# EAGLE design BladeCore-M40 (EAGLE 9.2.1)

## Sheet 1 of 2
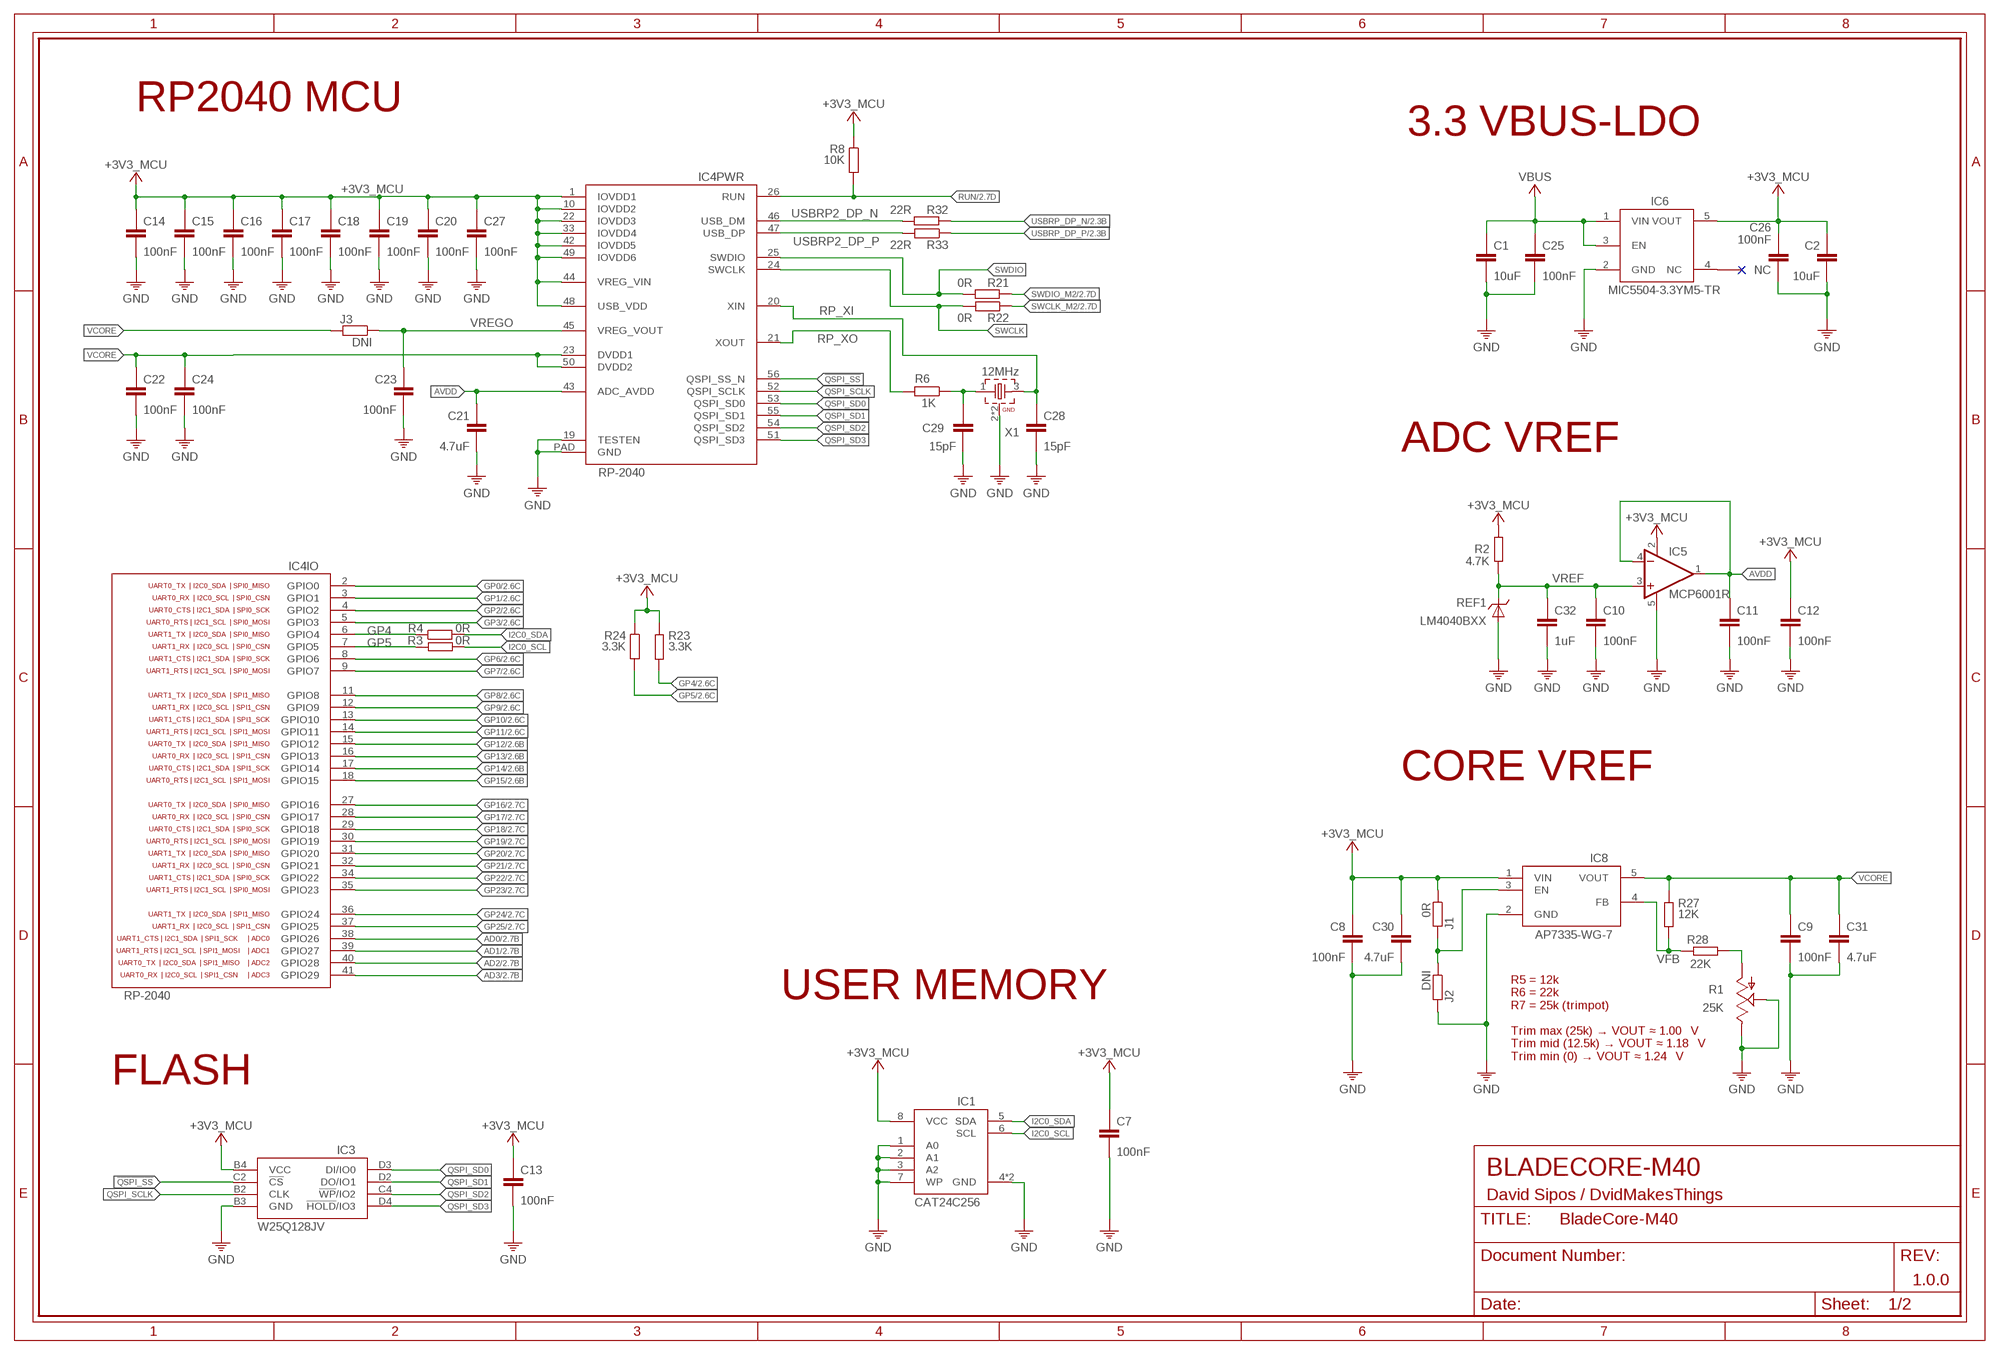
[diagram p0: schematic, sheet 1]

### Parts
C1  10uF  C0805  [0805]
C2  10uF  C0805  [0805]
C7  100nF  C-0201  [0201]
C8  100nF  C-0201  [0201]
C9  100nF  C-0201  [0201]
C10  100nF  C-0201  [0201]
C11  100nF  C-0201  [0201]
C12  100nF  C-0201  [0201]
C13  100nF  C-0201  [0201]
C14  100nF  C-0201  [0201]
C15  100nF  C-0201  [0201]
C16  100nF  C-0201  [0201]
C17  100nF  C-0201  [0201]
C18  100nF  C-0201  [0201]
C19  100nF  C-0201  [0201]
C20  100nF  C-0201  [0201]
C21  4.7uF  C-0402  [C0402]
C22  100nF  C-0201  [0201]
C23  100nF  C-0201  [0201]
C24  100nF  C-0201  [0201]
C25  100nF  C-0201  [0201]
C26  100nF  C-0201  [0201]
C27  100nF  C-0201  [0201]
C28  15pF  C-0201  [0201]
C29  15pF  C-0201  [0201]
C30  4.7uF  C-0402  [C0402]
C31  4.7uF  C-0402  [C0402]
C32  1uF  C-0402  [C0402]
IC1  CAT24C512HU5IGT3  CAT24C256-HU4  [SON50P300X200X50-9T130X140N]
IC3  W25Q128JVCIQ TR  W25Q128JVC  [BGA24C100P4X6_800X600X120N]
IC4  RP-2040  [QFN56]
IC5  MCP6001R  MCP6001RT  [SOT23-5]
IC6  MIC5504-3.3YM5-TR  [SOT23-5]
IC8  AP7335-WG-7  [SOT23-5]
J1  0R  R0201  [R0201]
J2  DNI  R0201  [R0201]
J3  DNI  R0201  [R0201]
R1  25K  35WR10KLFTR  [SMD_TRIMMER]
R2  4.7K  R0201  [R0201]
R3  0R  R0201  [R0201]
R4  0R  R0201  [R0201]
R6  1K  R0201  [R0201]
R8  10K  R0201  [R0201]
R21  0R  R0201  [R0201]
R22  0R  R0201  [R0201]
R23  3.3K  R0201  [R0201]
R24  3.3K  R0201  [R0201]
R27  12K  R0201  [R0201]
R28  22K  R0201  [R0201]
R32  22R  R0201  [R0201]
R33  22R  R0201  [R0201]
REF1  LM4040BXX  [SOT23]
X1  12MHz  WE-XTAL_CFPX-180_830069944  [WE-XTAL_CFPX-180]

### Nets
!QSPI_SS [50SE]: IC3.C2(!CS) IC4.56(PWR:QSPI_SS_N)
+3V3_MCU: C2.1 C7.1 C8.1 C12.1 C13.1 C14.1 C15.1 C16.1 C17.1 C18.1 C19.1 C20.1 C26.1 C27.1 C30.1 IC1.8(VCC) IC3.B4(VCC) IC4.1(PWR:IOVDD1) IC4.10(PWR:IOVDD2) IC4.22(PWR:IOVDD3) IC4.33(PWR:IOVDD4) IC4.42(PWR:IOVDD5) IC4.44(PWR:VREG_VIN) IC4.48(PWR:USB_VDD) IC4.49(PWR:IOVDD6) IC5.2(V+) IC6.5(VOUT) IC8.1(VIN) J1.1 R2.2 R8.1 R23.1 R24.1 ; also sheet 2
AD0 [50SE]: IC4.38(IO:GPIO26) ; also sheet 2
AD1 [50SE]: IC4.39(IO:GPIO27) ; also sheet 2
AD2 [50SE]: IC4.40(IO:GPIO28) ; also sheet 2
AD3 [50SE]: IC4.41(IO:GPIO29) ; also sheet 2
AVDD: C11.1 C21.1 IC4.43(PWR:ADC_AVDD) IC5.1(OUT) IC5.4(-IN)
FBTRIM: R1.3 R28.2
GND: C1.2 C2.2 C7.2 C8.2 C9.2 C10.2 C11.2 C12.2 C13.2 C14.2 C15.2 C16.2 C17.2 C18.2 C19.2 C20.2 C21.2 C22.2 C23.2 C24.2 C25.2 C26.2 C27.2 C28.2 C29.2 C30.2 C31.2 C32.2 IC1.1(A0) IC1.2(A1) IC1.3(A2) IC1.4(GND) IC1.7(WP) IC1.9(GND) IC3.B3(GND) IC4.19(PWR:TESTEN) IC4.PAD(PWR:GND) IC5.5(V-) IC6.2(GND) IC8.2(GND) J2.2 R1.1 R1.2 REF1.2(A) REF1.3(A) X1.2(GND) X1.4(GND) ; also sheet 2
GP0 [50SE]: IC4.2(IO:GPIO0) ; also sheet 2
GP1 [50SE]: IC4.3(IO:GPIO1) ; also sheet 2
GP2 [50SE]: IC4.4(IO:GPIO2) ; also sheet 2
GP3 [50SE]: IC4.5(IO:GPIO3) ; also sheet 2
GP4 [50SE]: IC4.6(IO:GPIO4) R4.1 R23.2 ; also sheet 2
GP5 [50SE]: IC4.7(IO:GPIO5) R3.1 R24.2 ; also sheet 2
GP6 [50SE]: IC4.8(IO:GPIO6) ; also sheet 2
GP7 [50SE]: IC4.9(IO:GPIO7) ; also sheet 2
GP8 [50SE]: IC4.11(IO:GPIO8) ; also sheet 2
GP9 [50SE]: IC4.12(IO:GPIO9) ; also sheet 2
GP10 [50SE]: IC4.13(IO:GPIO10) ; also sheet 2
GP11 [50SE]: IC4.14(IO:GPIO11) ; also sheet 2
GP12 [50SE]: IC4.15(IO:GPIO12) ; also sheet 2
GP13 [50SE]: IC4.16(IO:GPIO13) ; also sheet 2
GP14 [50SE]: IC4.17(IO:GPIO14) ; also sheet 2
GP15 [50SE]: IC4.18(IO:GPIO15) ; also sheet 2
GP16 [50SE]: IC4.27(IO:GPIO16) ; also sheet 2
GP17 [50SE]: IC4.28(IO:GPIO17) ; also sheet 2
GP18 [50SE]: IC4.29(IO:GPIO18) ; also sheet 2
GP19 [50SE]: IC4.30(IO:GPIO19) ; also sheet 2
GP20 [50SE]: IC4.31(IO:GPIO20) ; also sheet 2
GP21 [50SE]: IC4.32(IO:GPIO21) ; also sheet 2
GP22 [50SE]: IC4.34(IO:GPIO22) ; also sheet 2
GP23 [50SE]: IC4.35(IO:GPIO23) ; also sheet 2
GP24 [50SE]: IC4.36(IO:GPIO24) ; also sheet 2
GP25 [50SE]: IC4.37(IO:GPIO25) ; also sheet 2
I2C0_SCL [50SE]: IC1.6(SCL) R3.2
I2C0_SDA [50SE]: IC1.5(SDA) R4.2
N$2: IC8.3(EN) J1.2 J2.1
N$53: C29.1 R6.1 X1.1
QSPI_SCLK [50SE]: IC3.B2(CLK) IC4.52(PWR:QSPI_SCLK)
QSPI_SD0 [50SE]: IC3.D3(DI/IO0) IC4.53(PWR:QSPI_SD0)
QSPI_SD1 [50SE]: IC3.D2(DO/IO1) IC4.55(PWR:QSPI_SD1)
QSPI_SD2 [50SE]: IC3.C4(!WP!/IO2) IC4.54(PWR:QSPI_SD2)
QSPI_SD3 [50SE]: IC3.D4(!HOLD!/IO3) IC4.51(PWR:QSPI_SD3)
RP_XI: C28.1 IC4.20(PWR:XIN) X1.3
RP_XO: IC4.21(PWR:XOUT) R6.2
RUN: IC4.26(PWR:RUN) R8.2 ; also sheet 2
SWCLK: IC4.24(PWR:SWCLK) R22.2
SWCLK_M2: R22.1 ; also sheet 2
SWDIO: IC4.25(PWR:SWDIO) R21.2
SWDIO_M2: R21.1 ; also sheet 2
USBRP2_DP_N [90DP]: IC4.46(PWR:USB_DM) R32.2
USBRP2_DP_P [90DP]: IC4.47(PWR:USB_DP) R33.2
USBRP_DP_N [90DP]: R32.1 ; also sheet 2
USBRP_DP_P [90DP]: R33.1 ; also sheet 2
VBUS: C1.1 C25.1 IC6.1(VIN) IC6.3(EN) ; also sheet 2
VCORE: C9.1 C22.1 C24.1 C31.1 IC4.23(PWR:DVDD1) IC4.50(PWR:DVDD2) IC8.5(VOUT) J3.2 R27.1
VFB: IC8.4(FB) R27.2 R28.1
VREF: C10.1 C32.1 IC5.3(+IN) R2.1 REF1.1(C)
VREGO: C23.1 IC4.45(PWR:VREG_VOUT) J3.1
Unconnected: IC6.4(NC)

### Notes on the sheet
- RP2040 MCU
- 3.3 VBUS-LDO
- ADC VREF
- CORE VREF
- USER MEMORY
- R5 = 12k
  R6 = 22k
  R7 = 25k (trimpot)
  
  Trim max (25k) → VOUT ≈ 1.00 V  
  Trim mid (12.5k) → VOUT ≈ 1.18 V  
  Trim min (0) → VOUT ≈ 1.24 V
- FLASH
- BLADECORE-M40
- David Sipos / DvidMakesThings
- 1.0.0

## Sheet 2 of 2
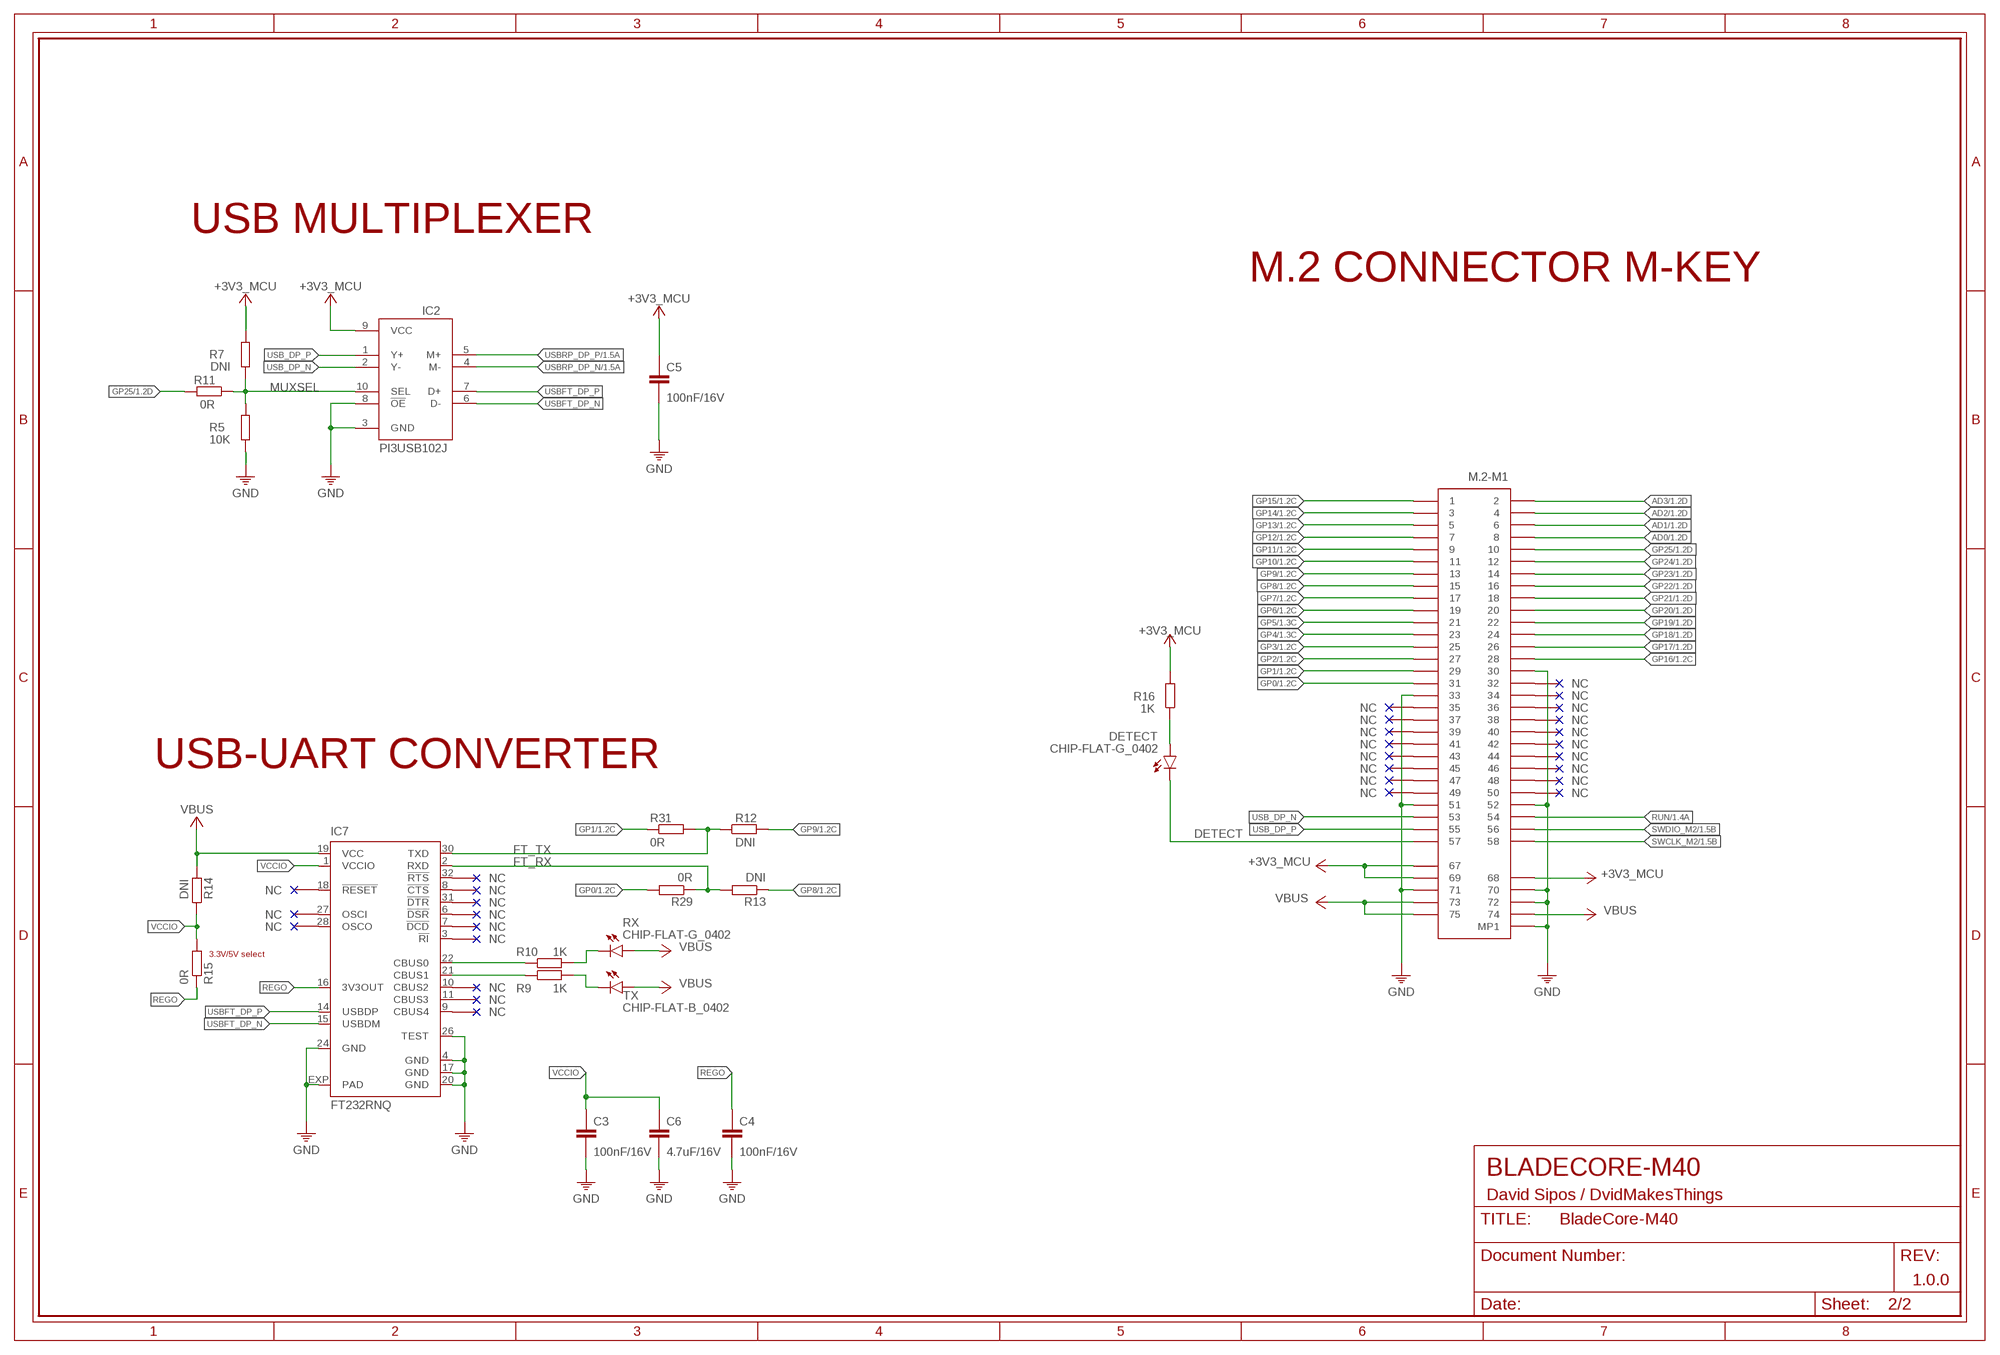
[diagram p1: schematic, sheet 2]

### Parts
C3  100nF/16V  C-0201  [0201]
C4  100nF/16V  C-0201  [0201]
C5  100nF/16V  C-0201  [0201]
C6  4.7uF/16V  C-0201  [0201]
DETECT  CHIP-FLAT-G_0402  [LEDC1005X25N_FLAT-G]
IC2  PI3USB102J  PI3USB102JXUCEX  [QFN40P120X140X35-10N]
IC7  FT232RNQ  FT232RQ  [QFN32]
M.2-M1  M.2-M-KEY  [M.2-M-KEY]
R5  10K  R0201  [R0201]
R7  DNI  R0201  [R0201]
R9  1K  R0201  [R0201]
R10  1K  R0201  [R0201]
R11  0R  R0201  [R0201]
R12  DNI  R0201  [R0201]
R13  DNI  R0201  [R0201]
R14  DNI  R0201  [R0201]
R15  0R  R0201  [R0201]
R16  1K  R0201  [R0201]
R29  0R  R0201  [R0201]
R31  0R  R0201  [R0201]
RX  CHIP-FLAT-G_0402  [LEDC1005X25N_FLAT-G]
TX  CHIP-FLAT-B_0402  [LEDC1005X25N_FLAT-B]

### Nets
+3V3_MCU: C5.1 IC2.9(VCC) M.2-M1.P$67 M.2-M1.P$68 M.2-M1.P$69 R7.2 R16.2 ; also sheet 1
AD0 [50SE]: M.2-M1.P$8 ; also sheet 1
AD1 [50SE]: M.2-M1.P$6 ; also sheet 1
AD2 [50SE]: M.2-M1.P$4 ; also sheet 1
AD3 [50SE]: M.2-M1.P$2 ; also sheet 1
DETECT: DETECT.C M.2-M1.P$57
FT_RX: IC7.2(RXD) R13.2 R29.1
FT_TX: IC7.30(TXD) R12.1 R31.2
GND: C3.2 C4.2 C5.2 C6.2 IC2.3(GND) IC2.8(!OE) IC7.4(GND) IC7.17(GND) IC7.20(GND) IC7.24(GND) IC7.26(TEST) IC7.EXP(PAD) M.2-M1.MT1(MP1) M.2-M1.P$30 M.2-M1.P$33 M.2-M1.P$51 M.2-M1.P$52 M.2-M1.P$70 M.2-M1.P$71 M.2-M1.P$72 R5.1 ; also sheet 1
GP0 [50SE]: M.2-M1.P$31 R29.2 ; also sheet 1
GP1 [50SE]: M.2-M1.P$29 R31.1 ; also sheet 1
GP2 [50SE]: M.2-M1.P$27 ; also sheet 1
GP3 [50SE]: M.2-M1.P$25 ; also sheet 1
GP4 [50SE]: M.2-M1.P$23 ; also sheet 1
GP5 [50SE]: M.2-M1.P$21 ; also sheet 1
GP6 [50SE]: M.2-M1.P$19 ; also sheet 1
GP7 [50SE]: M.2-M1.P$17 ; also sheet 1
GP8 [50SE]: M.2-M1.P$15 R13.1 ; also sheet 1
GP9 [50SE]: M.2-M1.P$13 R12.2 ; also sheet 1
GP10 [50SE]: M.2-M1.P$11 ; also sheet 1
GP11 [50SE]: M.2-M1.P$9 ; also sheet 1
GP12 [50SE]: M.2-M1.P$7 ; also sheet 1
GP13 [50SE]: M.2-M1.P$5 ; also sheet 1
GP14 [50SE]: M.2-M1.P$3 ; also sheet 1
GP15 [50SE]: M.2-M1.P$1 ; also sheet 1
GP16 [50SE]: M.2-M1.P$28 ; also sheet 1
GP17 [50SE]: M.2-M1.P$26 ; also sheet 1
GP18 [50SE]: M.2-M1.P$24 ; also sheet 1
GP19 [50SE]: M.2-M1.P$22 ; also sheet 1
GP20 [50SE]: M.2-M1.P$20 ; also sheet 1
GP21 [50SE]: M.2-M1.P$18 ; also sheet 1
GP22 [50SE]: M.2-M1.P$16 ; also sheet 1
GP23 [50SE]: M.2-M1.P$14 ; also sheet 1
GP24 [50SE]: M.2-M1.P$12 ; also sheet 1
GP25 [50SE]: M.2-M1.P$10 R11.2 ; also sheet 1
MUXSEL [50SE]: IC2.10(SEL) R5.2 R7.1 R11.1
N$6: DETECT.A R16.1
N$43: IC7.22(CBUS0) R10.1
N$109: IC7.21(CBUS1) R9.1
N$110: R9.2 TX.C
N$111: R10.2 RX.C
REGO: C4.1 IC7.16(3V3OUT) R15.1
RUN: M.2-M1.P$54 ; also sheet 1
SWCLK_M2: M.2-M1.P$58 ; also sheet 1
SWDIO_M2: M.2-M1.P$56 ; also sheet 1
USB_DP_N [90DP]: IC2.2(Y-) M.2-M1.P$53
USB_DP_P [90DP]: IC2.1(Y+) M.2-M1.P$55
USBFT_DP_N [90DP]: IC2.6(D-) IC7.15(USBDM)
USBFT_DP_P [90DP]: IC2.7(D+) IC7.14(USBDP)
USBRP_DP_N [90DP]: IC2.4(M-) ; also sheet 1
USBRP_DP_P [90DP]: IC2.5(M+) ; also sheet 1
VBUS: IC7.19(VCC) M.2-M1.P$73 M.2-M1.P$74 M.2-M1.P$75 R14.2 RX.A TX.A ; also sheet 1
VCCIO: C3.1 C6.1 IC7.1(VCCIO) R14.1 R15.2
Unconnected: IC7.3(!RI) IC7.6(!DSR) IC7.7(!DCD) IC7.8(!CTS) IC7.9(CBUS4) IC7.10(CBUS2) IC7.11(CBUS3) IC7.18(!RESET) IC7.27(OSCI) IC7.28(OSCO) IC7.31(!DTR) IC7.32(!RTS) M.2-M1.P$32 M.2-M1.P$34 M.2-M1.P$35 M.2-M1.P$36 M.2-M1.P$37 M.2-M1.P$38 M.2-M1.P$39 M.2-M1.P$40 M.2-M1.P$41 M.2-M1.P$42 M.2-M1.P$43 M.2-M1.P$44 M.2-M1.P$45 M.2-M1.P$46 M.2-M1.P$47 M.2-M1.P$48 M.2-M1.P$49 M.2-M1.P$50

### Notes on the sheet
- USB MULTIPLEXER
- M.2 CONNECTOR M-KEY
- USB-UART CONVERTER
- 3.3V/5V select
- BLADECORE-M40
- David Sipos / DvidMakesThings
- 1.0.0

## Library data of the parts
C1-C32 = ds_passive:C
DETECT RX = LED:CHIP-FLAT-G: Green LED - Generic; CATEGORY: LED; COLOR: Green; DESCRIPTION: Green LED Indication 0402 (1005 Metric); PACKAGE_SIZE: 0402; PACKAGE_TYPE: SMD; SUBCATEGORY: Chip LED; TYPE: Square with Flat Top
IC1 = ds_ic_memory:CAT24C256: The CAT24C256 is a EEPROM Serial 256−Kb I2C, internally organized as 32,768 words of 8 bits each. It features a 64−byte page write buffer and supports the Standard (100 kHz), Fast (400 kHz) and Fast−Plus (1 MHz) I2C protocol. Write operations can be inhibited by taking the WP pin High (this protects the entire memory). External address pins make it possible to address up to eight CAT24C256 devices on the same bus. On−Chip ECC (Error Correction Code) makes the device suitable for high reliability applications.
IC2 = ds_ic_peripherals:PI3USB102J: USB 2.0 High-Speed (480Mbps) Switch with 5V Protection
IC3 = ds_ic_memory:W25Q128JV: 3V 128M-BIT SERIAL FLASH MEMORY WITH DUAL/QUAD SPI & QPI & DTR
IC4 = ds_ic_mcu:RP-2040: Key features: • Dual ARM Cortex-M0+ @ 133MHz • 264kB on-chip SRAM in six independent banks • Support for up to 16MB of off-chip Flash memory via dedicated QSPI bus • DMA controller • Fully-connected AHB crossbar • Interpolator and integer divider peripherals • On-chip programmable LDO to generate core voltage • 2 on-chip PLLs to generate USB and core clocks • 30 GPIO pins, 4 of which can be used as analogue inputs • Peripherals ◦2 UARTs ◦2 SPI controllers ◦2 I2C controllers ◦16 PWM channels ◦USB 1.1 controller and PHY, with host and device support ◦8 PIO state machines; DATASHEET: https://datasheets.raspberrypi.com/rp2040/rp2040-datasheet.pdf
IC5 = ds_ic_opa:MCP6001RT: 1 MHz, Low-Power Op Amp
IC6 = ds_ic_vreg:MIC5504-3.3YM5-TR: The MIC5501/2/3/4 is an advanced general-purpose LDO ideal for powering general-purpose portable devices. The MIC5501/2/3/4 family of products provides a high-performance 300mA LDO
IC7 = ds_ic_peripherals:FT232RQ: FT232R USB UART IC; DATASHEET: https://ftdichip.com/wp-content/uploads/2020/08/DS_FT232R.pdf
IC8 = ds_ic_vreg:AP7335-WG-7: 300mA, LOW QUIESCENT CURRENT, FAST TRANSIENT LOW DROPOUT LINEAR REGULATOR; DATASHEET: https://www.diodes.com/assets/Datasheets/AP7335.pdf
J1-J3 R2-R16 R21-R24 R27-R29 R31-R33 = ds_passive:R
M.2-M1 = ds_con:M.2-M-KEY
R1 = Resistor_Capacitor:35WR10KLFTR: TRIMMER 10K OHM 0.1W TOP ADJ Manufacturer's datasheet <https://www.ttelectronics.com/TTElectronics/media/ProductFiles/Trimmers/Datasheets/35.pdf>; CREATED_BY: PCBLayout.com; DIGIKEY_PART_NUMBER: 987-1694-2-ND; MANUFACTURER: TT Electronics/BI; MPN: 35WR10KLFTR; PACKAGE: SMD
REF1 = ds_ic_vreg:LM4040BXX: Fixed voltage, 45-µA, precision micropower shunt voltage reference
TX = LED:CHIP-FLAT-B: Blue LED - Generic; CATEGORY: LED; COLOR: Blue; DESCRIPTION: Blue LED Indication 0402 (1005 Metric); PACKAGE_SIZE: 0402; PACKAGE_TYPE: SMD; SUBCATEGORY: Chip LED; TYPE: Square with Flat Top
X1 = Wurth_Quartz Crystals & Oscillators_WE-XTAL:WE-XTAL_CFPX-180: WE-XTAL Quartz Crystal Characteristics SMT and THT models Hermetically sealed Frequencies between 1.8432 MHz and 50 MHz Tolerances down to ±10 ppm available Maximum operating temperatures range: -40 °C to 85 °C Stabilities down to ±10 ppm available Applications Microprocessor Wireless Communication Devices Industrial Devices Wired Communication (e.g. Ethernet and USB) IoT Optical Network Audio and Multimedia Devices Test and Measurement Equipment Navigation and Locators Wearables <https://www.we-online.com/catalog/media/o135919v209%20Family_WE-XTAL_IQXC-42.jpg> Details see: https://www.we-online.com/catalog/en/WE-XTAL Updated by Ella Wu , 2020-11-23 2020 (C) Wurth Elektronik; C-LOAD: 15pF; DATASHEET-URL: https://www.we-online.com/catalog/datasheet/830069944.pdf; MOUNT: SMT; PART-NUMBER: 830069944; STABILITY: 30ppm; TOLERANCE: ±20ppm

## Net classes
0 default: width 0.17 mm, drill 0.15 mm, clearance 0.178 mm
1 50SE: width 0.17 mm, drill 0.15 mm, clearance 0.178 mm
2 90DP: width 0.167 mm, drill 0.15 mm, clearance 0.178 mm
3 50SE_INNER: width 0.147 mm, drill 0.15 mm, clearance 0.178 mm

## Board
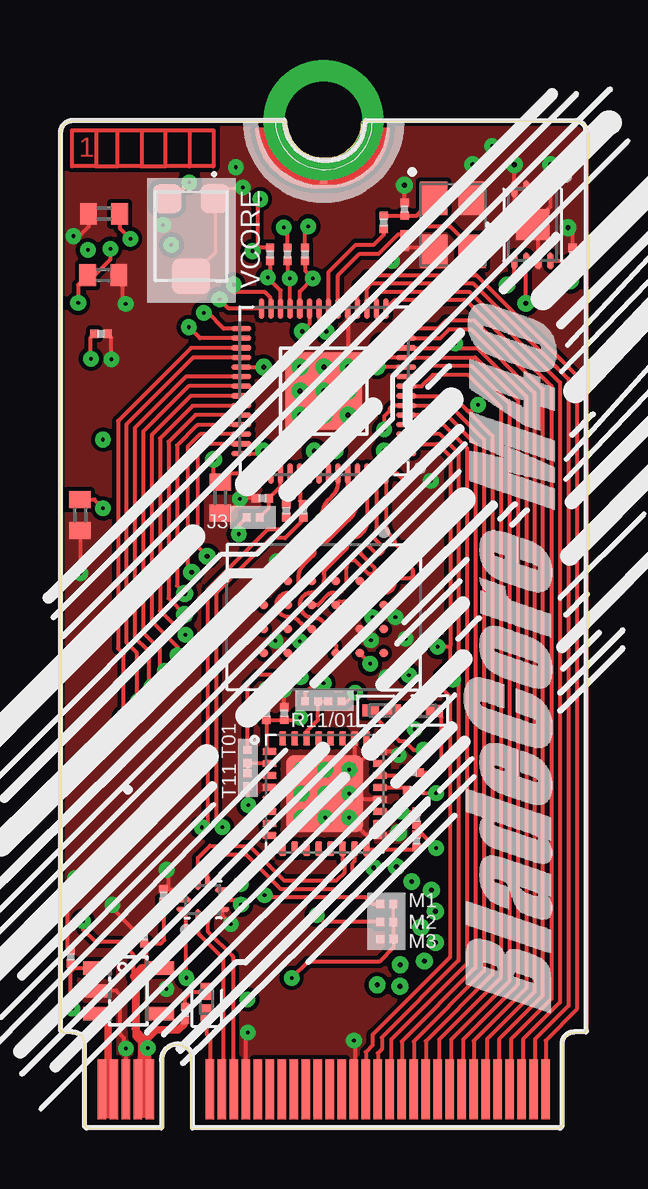
[diagram p2: board, top side]
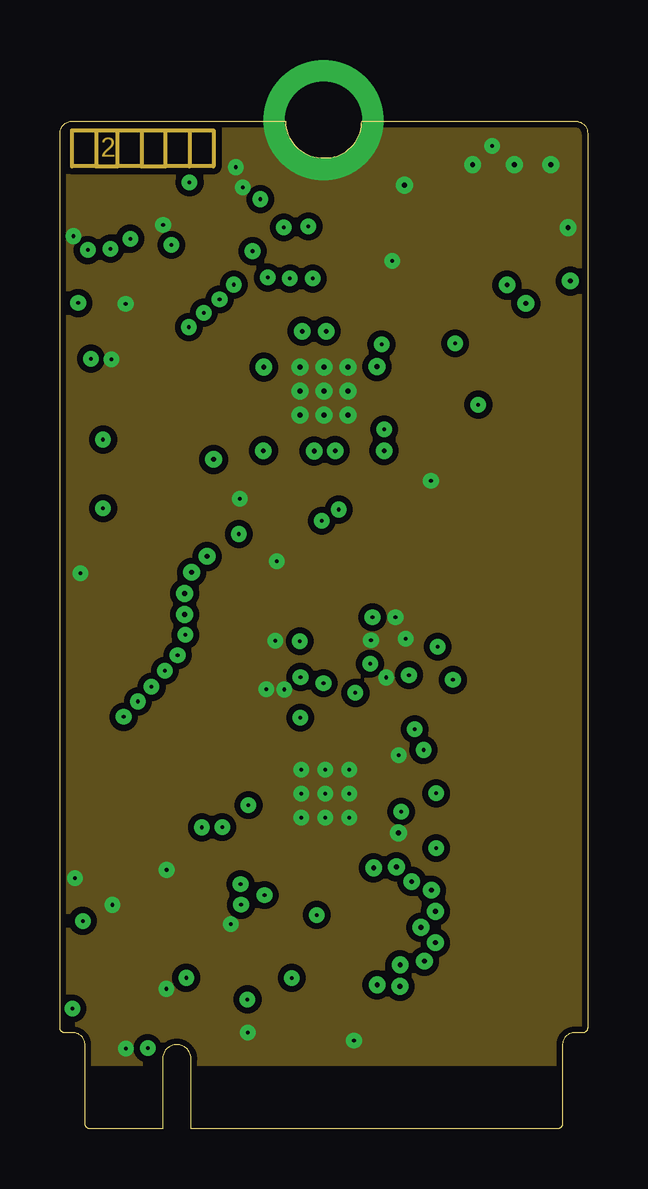
[diagram p3: board, inner layer L2-GND]
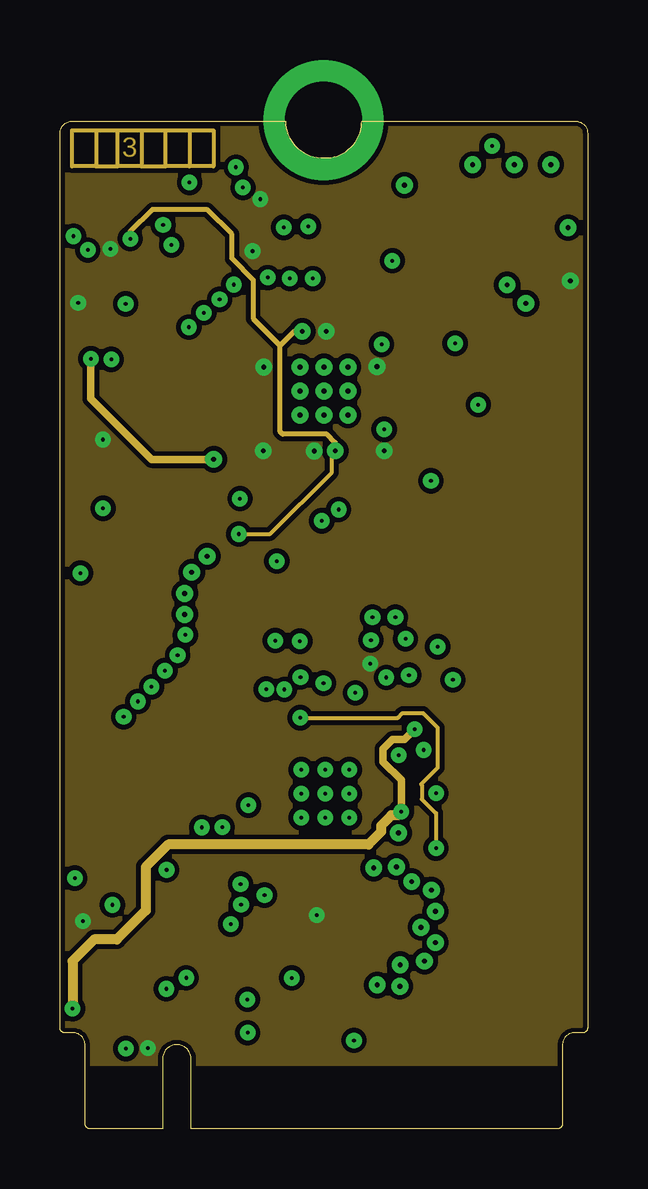
[diagram p4: board, inner layer L3-PWR]
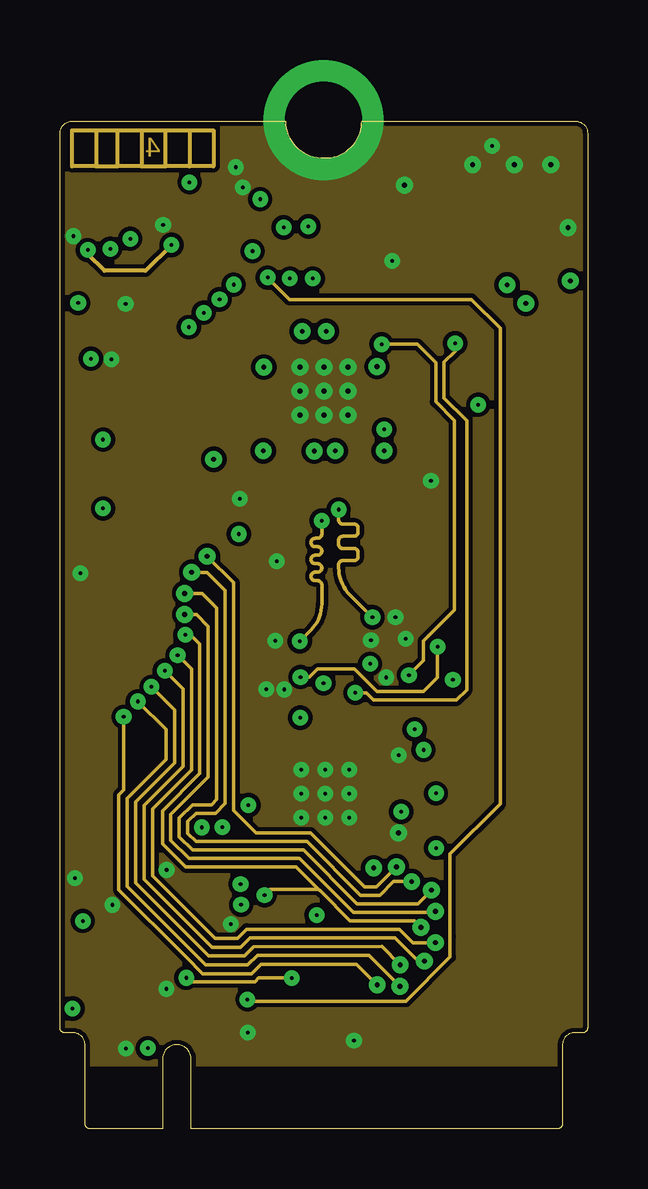
[diagram p5: board, inner layer L4-SIG]
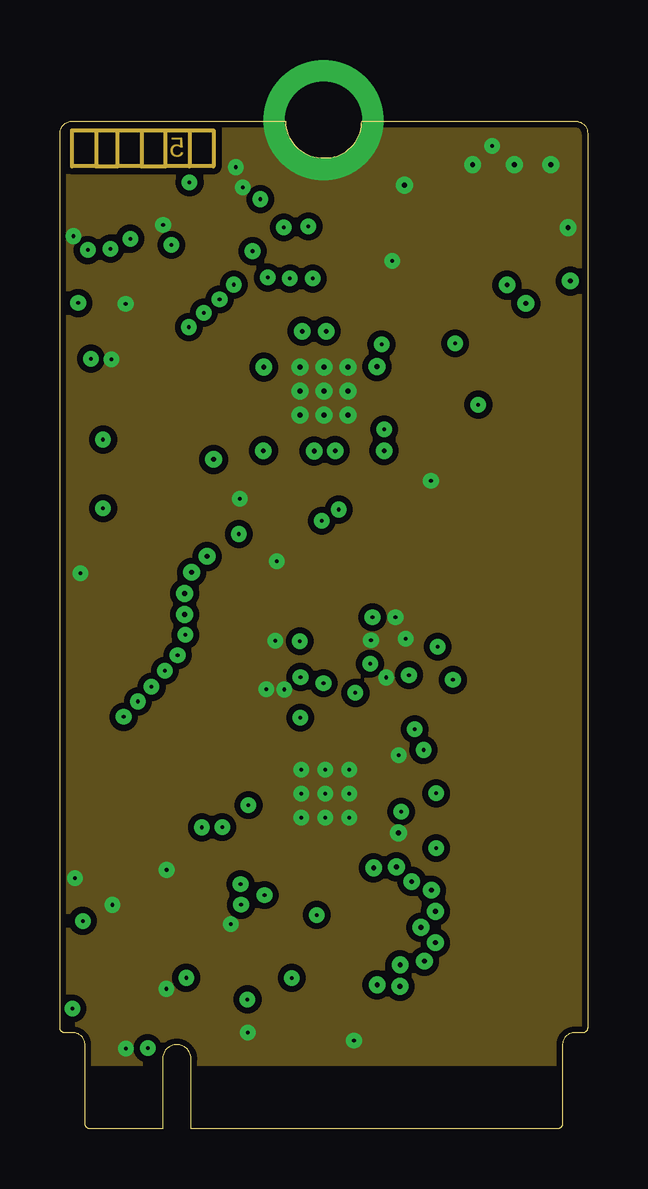
[diagram p6: board, inner layer L5-GND]
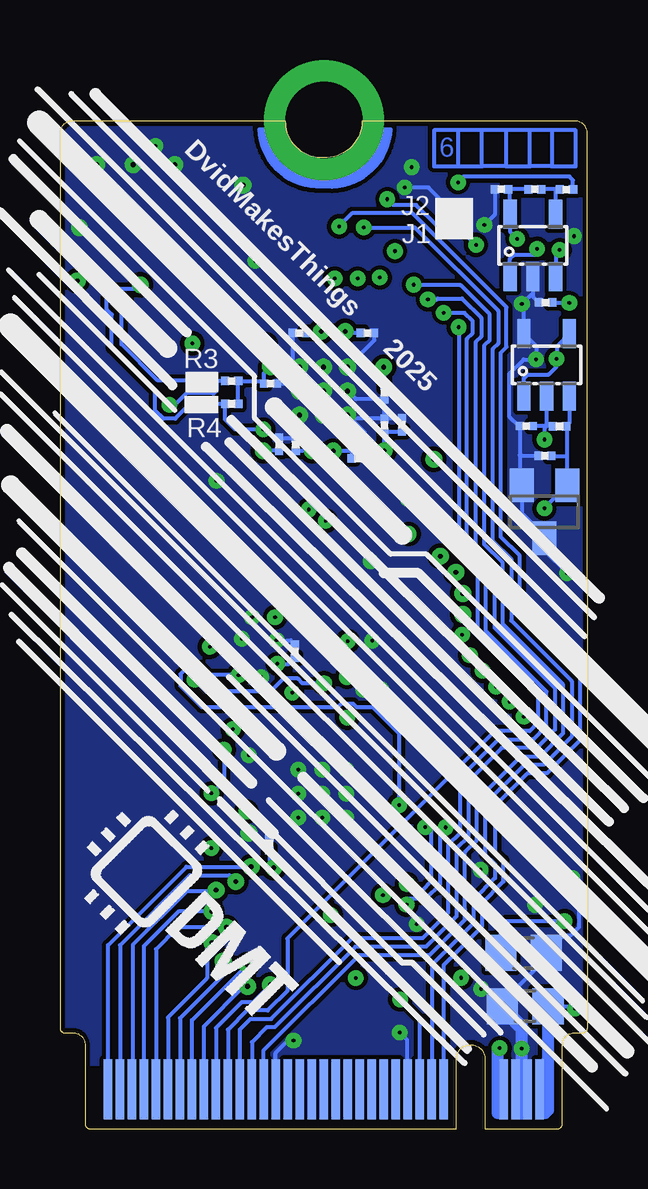
[diagram p7: board, bottom side, seen from below]

Size 22 x 42 mm. Coordinates in mm from the lower left corner, seen from the top.
Outline: 0,4.24 0,41.5 arc-90 0.5,42 9.4,42 arc90 11,40.47 arc90 12.58,41.92 12.6,42 21.5,42 arc-90 22,41.5 22,4.2 arc-90 21.8,4 21.45,4 arc90 20.95,3.5 20.95,0.2 arc-90 20.75,0 5.47,0 5.47,2.9 arc90 4.87,3.5 arc90 4.28,2.9 4.28,0 1.25,0 arc-90 1.05,0.2 1.05,3.5 arc90 0.55,4 0.2,4 arc-90 0,4.2 0,4.24
Copper layers (1+2*3+14*15+16): L1-HS 0.035mm / dielectric 0.2104mm / L2-GND 0.0152mm / dielectric 0.075mm / L3-PWR 0.0152mm / dielectric 0.1088mm / L4-SIG 0.0152mm / dielectric 0.075mm / L5-GND 0.0152mm / dielectric 0.2104mm / L6-SIG 0.035mm
Design rules "JLC06161H-3313_6-layer *": minimum track width 0.1mm, minimum drill 0.15mm, track to track 3.5mil, track to pad 3.5mil, pad to pad 3.5mil, via to via 3.5mil, smd to smd 3.5mil, copper to edge 0.2mm, drill to drill 6mil, minimum pad ring 8mil, minimum via ring 0.25mm, stop-mask expansion 0.05mm, vias tented up to drill 16mil, thermal gap 10mil

### Footprints (pad centres in the part's own frame; a part is rotated, then mirrored left to right if it is on the bottom)
0805 = smd 1.3 x 1.5: 1 -0.95,0; 2 0.95,0
0201 = smd 0.34 x 0.35: 1 -0.275,0; 2 0.275,0
C0402 = smd 0.7 x 0.9: 1 -0.65,0; 2 0.65,0
LEDC1005X25N_FLAT-G = smd 0.7 x 0.5: A 0.45,0; C -0.45,0
SON50P300X200X50-9T130X140N = smd 0.711 x 0.27: 1 -1.501,0.75; 2 -1.501,0.25; 3 -1.501,-0.25; 4 -1.501,-0.75; 5 1.501,-0.75; 6 1.501,-0.25; 7 1.501,0.25; 8 1.501,0.75 | smd 1.3 x 1.4: 9 0,0
QFN40P120X140X35-10N = smd 0.612 x 0.203: 1 -0.7,0.2; 2 -0.7,-0.2; 6 0.7,-0.2; 7 0.7,0.2 | smd 0.203 x 0.612: 3 -0.4,-0.8; 4 0,-0.8; 5 0.4,-0.8; 8 0.4,0.8; 9 0,0.8; 10 -0.4,0.8
BGA24C100P4X6_800X600X120N = smd 0.35 x 0.35: A1 -1.5,2.5; A2 -0.5,2.5; A3 0.5,2.5; A4 1.5,2.5; B1 -1.5,1.5; B2 -0.5,1.5; B3 0.5,1.5; B4 1.5,1.5; C1 -1.5,0.5; C2 -0.5,0.5; C3 0.5,0.5; C4 1.5,0.5; D1 -1.5,-0.5; D2 -0.5,-0.5; D3 0.5,-0.5; D4 1.5,-0.5; E1 -1.5,-1.5; E2 -0.5,-1.5; E3 0.5,-1.5; E4 1.5,-1.5; F1 -1.5,-2.5; F2 -0.5,-2.5; F3 0.5,-2.5; F4 1.5,-2.5
QFN56 = smd 0.837 x 0.22: 1 -3.437,2.6; 2 -3.437,2.2; 3 -3.437,1.8; 4 -3.437,1.4; 5 -3.437,1; 6 -3.437,0.6; 7 -3.437,0.2; 8 -3.437,-0.2; 9 -3.437,-0.6; 10 -3.437,-1; 11 -3.437,-1.4; 12 -3.437,-1.8; 13 -3.437,-2.2; 14 -3.437,-2.6; 29 3.437,-2.6; 30 3.437,-2.2; 31 3.437,-1.8; 32 3.437,-1.4; 33 3.437,-1; 34 3.437,-0.6; 35 3.437,-0.2; 36 3.437,0.2; 37 3.437,0.6; 38 3.437,1; 39 3.437,1.4; 40 3.437,1.8; 41 3.437,2.2; 42 3.437,2.6 | smd 0.22 x 0.837: 15 -2.6,-3.437; 16 -2.2,-3.437; 17 -1.8,-3.437; 18 -1.4,-3.437; 19 -1,-3.437; 20 -0.6,-3.437; 21 -0.2,-3.437; 22 0.2,-3.437; 23 0.6,-3.437; 24 1,-3.437; 25 1.4,-3.437; 26 1.8,-3.437; 27 2.2,-3.437; 28 2.6,-3.437; 43 2.6,3.437; 44 2.2,3.437; 45 1.8,3.437; 46 1.4,3.437; 47 1,3.437; 48 0.6,3.437; 49 0.2,3.437; 50 -0.2,3.437; 51 -0.6,3.437; 52 -1,3.437; 53 -1.4,3.437; 54 -1.8,3.437; 55 -2.2,3.437; 56 -2.6,3.437 | smd 3.2 x 3.2: PAD 0,0
SOT23-5 = smd 0.55 x 1.2: 1 -0.95,-1.3; 2 0,-1.3; 3 0.95,-1.3; 4 0.95,1.3; 5 -0.95,1.3
QFN32 = smd 0.6 x 0.3: 1 -2.3,1.75; 2 -2.3,1.25; 3 -2.3,0.75; 4 -2.3,0.25; 5 -2.3,-0.25; 6 -2.3,-0.75; 7 -2.3,-1.25; 8 -2.3,-1.75; 17 2.3,-1.75; 18 2.3,-1.25; 19 2.3,-0.75; 20 2.3,-0.25; 21 2.3,0.25; 22 2.3,0.75; 23 2.3,1.25; 24 2.3,1.75 | smd 0.3 x 0.6: 9 -1.75,-2.3; 10 -1.25,-2.3; 11 -0.75,-2.3; 12 -0.25,-2.3; 13 0.25,-2.3; 14 0.75,-2.3; 15 1.25,-2.3; 16 1.75,-2.3; 25 1.75,2.3; 26 1.25,2.3; 27 0.75,2.3; 28 0.25,2.3; 29 -0.25,2.3; 30 -0.75,2.3; 31 -1.25,2.3; 32 -1.75,2.3 | smd 3.2 x 3.2: EXP 0,0
R0201 = smd 0.34 x 0.35: 1 -0.275,0; 2 0.275,0
M.2-M-KEY = smd 0.305 x 0.152: MT1 -0.5,17.6 | smd 0.35 x 2.5: P$1 8.75,-20.21; P$3 8.25,-20.21; P$5 7.75,-20.21; P$7 7.25,-20.21; P$9 6.75,-20.21; P$11 6.25,-20.21; P$13 5.75,-20.21; P$15 5.25,-20.21; P$17 4.75,-20.21; P$19 4.25,-20.21; P$21 3.75,-20.21; P$23 3.25,-20.21; P$25 2.75,-20.21; P$27 2.25,-20.21; P$29 1.75,-20.21; P$31 1.25,-20.21; P$33 0.75,-20.21; P$35 0.25,-20.21; P$37 -0.25,-20.21; P$39 -0.75,-20.21; P$41 -1.25,-20.21; P$43 -1.75,-20.21; P$45 -2.25,-20.21; P$47 -2.75,-20.21; P$49 -3.25,-20.21; P$51 -3.75,-20.21; P$53 -4.25,-20.21; P$55 -4.75,-20.21; P$57 -5.25,-20.21; P$67 -7.75,-20.21; P$69 -8.25,-20.21; P$71 -8.75,-20.21; P$73 -9.25,-20.21; P$75 -9.75,-20.21 | smd 0.35 x 2.5 bottom: P$2 8.5,-20.21; P$4 8,-20.21; P$6 7.5,-20.21; P$8 7,-20.21; P$10 6.5,-20.21; P$12 6,-20.21; P$14 5.5,-20.21; P$16 5,-20.21; P$18 4.5,-20.21; P$20 4,-20.21; P$22 3.5,-20.21; P$24 3,-20.21; P$26 2.5,-20.21; P$28 2,-20.21; P$30 1.5,-20.21; P$32 1,-20.21; P$34 0.5,-20.21; P$36 0,-20.21; P$38 -0.5,-20.21; P$40 -1,-20.21; P$42 -1.5,-20.21; P$44 -2,-20.21; P$46 -2.5,-20.21; P$48 -3,-20.21; P$50 -3.5,-20.21; P$52 -4,-20.21; P$54 -4.5,-20.21; P$56 -5,-20.21; P$58 -5.5,-20.21; P$68 -8,-20.21; P$70 -8.5,-20.21; P$72 -9,-20.21; P$74 -9.5,-20.21
SMD_TRIMMER = smd 1.2 x 1.2: 1 -1,-1.6; 3 1,-1.6 | smd 1.6 x 1.5: 2 0,1.65
SOT23 = smd 1 x 1.4: 1 -0.95,-1.1; 2 0.95,-1.1; 3 0,1.1
LEDC1005X25N_FLAT-B = smd 0.7 x 0.5: A 0.45,0; C -0.45,0
WE-XTAL_CFPX-180 = smd 1.4 x 1.15: 1 -1.1,-0.8; 2 1.1,-0.8; 3 1.1,0.8; 4 -1.1,0.8

### Placement (x,y rotation side)
C1  2.6,5.11 180 bottom
C2  2.67,7.33 0 bottom
C3  9.35,17.31 90 top
C4  13.27,11.88 90 bottom
C5  4.32,9.73 90 top
C6  8.61,17.31 90 top
C7  21.38,36.44 90 top
C8  1.75,34.44 180 bottom
C9  3.59,39.16 180 bottom
C10  1.78,28.05 180 bottom
C11  1.71,33.13 0 top
C12  2.55,29.29 180 bottom
C13  12.2,19.9 90 bottom
C14  12.87,28.52 90 bottom
C15  8.47,29.32 90 bottom
C16  9.56,27.95 0 bottom
C17  13.22,31.06 0 bottom
C18  7.74,29.35 90 bottom
C19  12.02,33.17 180 bottom
C20  8.47,30.68 270 bottom
C21  6.69,26.31 270 top
C22  9.18,33.17 0 bottom
C23  8.44,26.28 180 top
C24  12.17,28.52 90 bottom
C25  0.45,7.16 90 top
C26  3.51,8.01 90 top
C27  9.56,28.67 0 bottom
C28  14.37,37.02 270 top
C29  14.37,38.33 90 top
C30  1.81,35.58 0 top
C31  1.84,38.14 180 top
C32  0.84,25.58 270 top
DETECT  6.12,5.28 90 top
IC1  19.7,37.68 270 top
IC2  5.96,9.55 90 top
IC3  11,21.33 270 top
IC4  11,30.75 180 top
IC5  1.71,31.84 0 bottom
IC6  2.86,5.75 270 top
IC7  11.04,13.97 0 top
IC8  2.28,36.82 0 bottom
J1  5.53,37.64 0 bottom
J2  5.51,38.38 180 bottom
J3  8.05,25.49 180 top
M.2-M1  11.5,21.86 0 top
R1  5.47,37.17 180 top
R2  1.17,29.28 180 bottom
R3  16.18,31.19 180 bottom
R4  16.17,30.22 180 bottom
R5  13.64,7.9 0 top
R6  13.5,37.78 270 top
R7  13.63,8.62 180 top
R8  8.76,36.45 270 top
R9  14.74,14.12 0 top
R10  14.74,14.85 0 top
R11  13.63,9.36 180 top
R12  11.46,17.81 0 top
R13  7.82,14.54 90 top
R14  14.87,12.94 90 top
R15  14.87,12 90 top
R16  5.22,4.81 270 top
R21  9.49,36.45 270 top
R22  10.22,36.45 270 top
R23  14.84,30.22 180 bottom
R24  14.84,31.17 180 bottom
R27  2.2,39.16 0 bottom
R28  0.88,39.15 0 bottom
R29  7.82,15.51 90 top
R31  10.49,17.81 0 top
R32  9.44,25.76 90 top
R33  10.15,25.76 90 top
REF1  1.8,25.72 180 bottom
RX  15.17,17.42 180 top
TX  13.41,17.43 0 top
U$1  [DMT]  18.44,10.7 315 bottom
X1  16.39,37.67 270 top

### Tracks (layer width: path | path; a pad name or v marks a point on that pad's centre or on a via)
!QSPI_SS
  L1-HS 0.17: 14.3,27.07 14.06,27.31 IC4.56 13.6,25.16 arc45 13.78,24.73 13.9,24.61 arc-45 13.96,24.46 arc90 14.14,24.28 14.55,24.28 arc-90 14.73,24.11 14.73,24.02 arc-90 14.55,23.84 14.14,23.84 arc90 13.96,23.66 13.96,23.57 arc90 14.14,23.39 14.55,23.39 arc-90 14.73,23.22 14.73,23.12 arc-90 14.55,22.95 14.14,22.95 arc90 13.96,22.77 arc-90 13.52,22.33 12.59,22.33 arc45 12.22,22.18 12.15,22.11 arc-45 11.85,21.98 11.65,21.98 IC3.C2
+3V3_MCU  (via drill 0.15, 0.2)
  L1-HS 0.17: 10.6,27.31 v10.6,28.25 | IC4.44 8.8,27.94 8.5,28.25 | 8.5,28.25 v8.48,28.26 | IC4.42 8.4,28.15 8.5,28.25 | IC4.33 v8.5,31.75 | IC4.22 10.8,33.54 v11.1,33.24 | IC4.10 13.24,31.75 v13.22,31.77 | IC4.1 13.63,28.15 v13.52,28.26 | IC6.5 3.6,6.7 | 3.17,4.05 3.07,4.16 3.07,6.17 | v3.66,3.36 3.66,3.16 | 3.66,3.16 3.66,2.69 | 3.66,2.69 3.66,2.52 3.66,2 | 3.66,2 3.66,1.65 | 3.6,6.7 3.17,6.28 3.07,6.17 | v12.93,19.38 12.5,19.81 IC3.B4 | IC1.8 21.37,36.18 C7.1 21.38,35.44 v21.28,35.34 | IC2.9 4.41,9.55 C5.1 4.35,9.43 4.35,7.87 4.21,7.74 C26.1 3.6,7.64 3.6,6.7 | R8.1 8.24,36.72 | 8.24,36.72 8.17,36.72 v8.03,36.58 | v0.76,34.42 0.76,35.18 C30.1 1.45,35.58 2.1,36.23 v2.1,36.68 | 3.07,6.17 3.07,6.36 3.07,7.24 2.52,7.79 1.48,7.79 0.95,8.32 v0.95,8.66 | 10.6,27.31 IC4.48 | IC4.49 10.6,27.31 | 3.66,1.65 M.2-M1.P$67 3.56,1.65 3.46,1.55 3.37,1.55 | 3.66,3.16 3.47,2.97 3.36,2.86 3.25,2.75 M.2-M1.P$69 3.6,2 3.66,2 | 3.66,1.65 3.5,1.49 | 3.5,1.49 3.5,0.53 | 3.5,1.49 3.5,2.53 3.66,2.69 | R16.2 5.22,4.41 5.17,4.36 | 4.01,4.12 3.65,3.76 3.56,3.67 | R7.2 11,8.62 v10.71,8.91 | v8.35,38.75 8.24,38.64 8.24,36.72
  L1-HS 0.305: IC6.5 3.41,6.7 3.07,6.36 | 3.17,6.28 3.17,4.05 | 3.17,4.05 3.56,3.67 | 3.56,3.67 3.57,3.65 3.41,3.49 3.41,1.77 3.29,1.65 | v3.66,3.36 3.66,3.75 3.65,3.76 | v3.66,3.36 3.66,3.77 4.01,4.12 4.93,4.12 5.17,4.36 | v3.66,3.36 3.66,2.52 | M.2-M1.P$67 3.75,2.48 3.36,2.86 | v3.66,3.36 3.47,3.17 3.47,2.97 | v3.66,3.36 3.54,3.48 3.4,3.48 3.56,3.64 3.56,3.67 | v3.66,3.36 3.17,3.84 3.17,4.05
  L6-SIG 0.17: v12.93,19.38 12.44,19.38 C13.1 | C27.1 9.83,28.3 | 9.83,28.3 C16.1 | 9.83,28.3 9.88,28.25 v10.6,28.25 | C14.1 v13.52,28.26 | C15.1 8.48,29.03 | 8.48,29.03 v8.48,28.26 | C18.1 7.78,29.03 8.48,29.03 | C20.1 8.47,31.72 v8.5,31.75 | C17.1 13.49,31.14 | 13.49,31.14 13.49,31.5 v13.22,31.77 | C19.1 11.17,33.17 v11.1,33.24 | 1.47,34.42 C8.1 0.78,34.44 v0.76,34.42 | IC8.1 3.23,36.26 3.05,36.44 2.1,36.44 v2.1,36.68 | R2.2 1.71,29.28 | 1.71,29.28 C12.1 | IC5.2 1.71,29.28 | 1.71,29.28 1.8,29.19 v1.8,28.73 | v0.95,8.66 3.42,8.66 3.62,8.46 C2.1 3.33,7.04 | 13.49,31.14 13.52,31.17 R24.1 R23.1 | J1.1 6.28,37.64 7.15,38.51 8.11,38.51 v8.35,38.75
  L6-SIG 0.254: M.2-M1.P$68 3.69,1.46 3.69,0.61 | 3.69,0.57 3.69,0.61 | 3.69,0.61 3.74,0.66
  L6-SIG 0.508: 3.74,0.66 3.74,3.28 v3.66,3.36
  pour L3-PWR (isolate 0.2, rank 6, no thermals): -1.32,42.01 23.22,42.01 23.22,2.72 -1.32,2.72
AD0  (via drill 0.2)
  L1-HS 0.17: IC4.38 5.65,29.75 4.53,28.63 4.53,22.11 v5.2,21.44
  L4-SIG 0.147: v5.2,21.44 5.69,21.44 6.18,20.95 6.18,14.66 4.62,13.1 4.62,12.02 5.38,11.27 10,11.27 12.24,9.03 15.62,9.03 v15.65,9.06
  L6-SIG 0.17: M.2-M1.P$8 18.5,7.62 17.06,9.06 v15.65,9.06
AD1  (via drill 0.2)
  L1-HS 0.17: IC4.39 7.54,29.32 5.72,29.32 4.88,28.48 4.88,22.64 v5.2,22.32
  L4-SIG 0.147: v5.2,22.32 5.92,22.32 6.54,21.7 6.54,13.72 6.31,13.5 5.53,13.5 4.97,12.95 4.97,12.17 5.53,11.62 10.15,11.62 12.39,9.38 14.92,9.38 v15.49,9.94
  L6-SIG 0.17: M.2-M1.P$6 18.94,1.71 18.94,7.69 16.71,9.93 15.51,9.93 v15.49,9.94
AD2  (via drill 0.2)
  L1-HS 0.17: IC4.40 5.84,28.95 5.33,28.44 5.33,23.36 v5.49,23.19
  L4-SIG 0.147: v5.49,23.19 6.13,23.19 6.89,22.43 6.89,13.55 6.49,13.15 5.67,13.15 5.33,12.8 5.33,12.32 5.67,11.97 10.3,11.97 12.54,9.73 13.33,9.73 13.91,10.3 v14.67,10.3
  L6-SIG 0.17: v14.67,10.3 14.93,10.56 16.59,10.56 19.5,7.65 M.2-M1.P$4
AD3  (via drill 0.2)
  L1-HS 0.17: IC4.41 5.94,28.55 5.73,28.34 5.73,24.27 v6.14,23.86
  L4-SIG 0.147: v6.14,23.86 7.24,22.76 7.24,13.28 8.19,12.33 10.45,12.33 12.7,10.08 13.19,10.08 v14.03,10.92
  L6-SIG 0.17: M.2-M1.P$2 20,7.65 16.73,10.92 v14.03,10.92
AVDD  (via drill 0.15, 0.2)
  L1-HS 0.17: IC4.43 7.04,27.31 C21.1 6.41,27.24 v6.41,27.9 | v1.29,32.1 1.29,32.99 C11.1
  L3-PWR 0.305: v1.29,32.1 1.29,30.43 3.82,27.9 v6.41,27.9
  L6-SIG 0.17: IC5.4 1.29,32.61 v1.29,32.1 1.29,31.77 1.62,31.44 2.49,31.44 2.66,31.27 IC5.1
DETECT
  L1-HS 0.17: DETECT.C 6.12,3.93 6.25,3.8 M.2-M1.P$57
FBTRIM  (via drill 0.15)
  L1-HS 0.17: v5.4,39.45 4.72,38.77 R1.3
  L6-SIG 0.17: R28.2 0.6,39.53 0.76,39.69 5.16,39.69 v5.4,39.45
FT_RX
  L1-HS 0.17: R13.2 R29.1 7.83,15.22 IC7.2
FT_TX
  L1-HS 0.17: IC7.30 10.29,16.57 10.76,17.05 R31.2 R12.1
GND  (via drill 0.15, 0.2, 3.2 pad 5)
  L1-HS 0.17: v12.97,20.37 IC3.B3 | IC7.4 10.79,14.22 IC7.EXP 11.13,13.88 | IC7.20 12.27,13.72 | 12.27,13.72 11.29,13.72 11.13,13.88 | 12.27,13.72 12.28,13.71 12.28,12.73 12.76,12.25 13.03,12.25 13.06,12.22 IC7.17 14.01,12.22 v14.12,12.33 | X1.2 15.42,36.74 C28.2 13.86,36.23 v13.86,36.18 | C29.2 v14.37,39.33 | X1.4 17.21,38.79 v17.21,40.18 | IC1.4 IC1.3 | IC1.3 IC1.2 | IC1.2 IC1.1 | IC1.4 v18.95,40.18 | IC1.1 20.45,40.17 v20.47,40.19 | IC1.3 19.45,37.93 | 19.45,37.93 IC1.9 19.73,37.71 | IC1.2 19.95,37.93 | 19.95,37.93 19.73,37.71 | IC1.1 20.45,38.43 19.95,37.93 | IC1.4 18.95,38.43 19.45,37.93 | IC1.7 19.95,37.5 19.73,37.71 | C7.2 21.38,37.37 v21.19,37.56 | IC4.19 v12,31.75 IC4.PAD | C23.2 7.52,26.28 v7.51,26.26 7.55,26.21 7,25.66 C21.2 | C5.2 4.38,9.95 IC2.8 4.61,9.95 4.51,10.05 4.51,10.73 v4.45,10.79 | IC2.3 6.76,8.89 v7.12,8.53 | C6.2 8.6,17.59 v8.6,18.32 | C3.2 v9.35,18.3 v9.36,18.31 | IC7.26 12.29,15.04 | 12.29,15.04 11.13,13.88 | 12.29,15.04 12.96,15.71 13.02,15.71 13.04,15.72 IC7.24 13.98,15.72 v14.13,15.57 | v7.63,39.23 7.59,39.19 6.89,39.19 R1.1 6.47,36.52 R1.2 | v2.14,32.07 2.14,32.97 C11.2 | C32.2 v0.84,23.17 v0.85,23.16 | C30.2 2.59,35.45 2.59,34.53 v2.74,34.38 | C31.2 1.19,37.6 0.8,37.21 v0.57,37.21 | IC6.2 2.35,5.75 2.51,5.59 2.51,3.93 2.66,3.78 2.66,3.43 v2.75,3.34 M.2-M1.P$71 | v0.62,10.45 0.31,10.14 0.31,7.58 C25.2 | C26.2 3.08,8.29 2.19,9.18 v2.19,9.33 | M.2-M1.P$33 12.31,1.71 12.31,3.55 | v7.83,4 7.75,3.92 M.2-M1.P$51
  L6-SIG 0.17: v12.97,20.37 v12.96,20.36 12.38,20.36 C13.2 | C16.2 C27.2 9.29,29.03 9.85,29.59 | C18.2 7.77,29.59 C15.2 | C15.2 C20.2 9.66,30.4 v10.01,30.75 | C15.2 9.85,29.59 | 9.85,29.59 v10.01,29.75 | v12.01,29.75 12.17,29.59 C24.2 C14.2 | C17.2 12.32,31.06 v12.01,30.75 | C19.2 12.29,32.03 v12.01,31.75 | C22.2 8.9,32.85 v10.01,31.75 | C9.2 3.86,38.1 v4.3,37.67 | C8.2 2.28,34.7 IC8.2 2.28,34.84 v2.74,34.38 2.66,34.3 IC5.5 2.14,32.62 v2.14,32.07 2.66,32.07 3.25,31.48 3.25,29.67 2.87,29.29 C12.2 2.82,28.08 | v0.85,23.16 1.8,24.11 REF1.3 1.8,24.71 2.75,25.66 REF1.2 2.82,26.89 2.82,28.08 | C10.2 2.79,28.05 2.82,28.08 | C1.2 3.55,4.72 2.76,3.93 M.2-M1.P$71 | v4.43,5.83 4.27,5.83 C1.2 | C1.2 3.55,5.27 1.72,7.1 C2.2 0.99,8.06 0.7,8.06 0.35,8.41 0.35,10.18 v0.62,10.45 | M.2-M1.P$72 M.2-M1.P$71 | M.2-M1.P$70 M.2-M1.P$71 | M.2-M1.P$52 7.52,1.67 7.52,3.69 v7.83,4 | M.2-M1.P$30 13,3.16 12.48,3.68 v12.26,3.68 | J2.2 6.63,39.23 v7.63,39.23
  L6-SIG 0.508: C1.2 2.76,4.32 2.76,0.64
  other vias: 11.01,30.75 11.01,31.75 11.01,29.75 8.98,20.35 13.99,21.32 14.41,20.42 9.04,23.66 15.47,27.01 11.06,13.97 10.06,13.97 10.06,14.97 11.06,14.97 12.06,14.97 12.06,13.97 12.06,12.97 11.06,12.97 10.06,12.97 13.61,18.81 7.34,40.08 18.02,40.97 10.99,42.05
  pour L2-GND (isolate 0.254, no thermals): -0.97,41.99 22.93,41.99 22.93,2.73 -0.97,2.73
  pour L5-GND (isolate 0.254, no thermals): -2.16,42 23.83,42 23.83,2.72 -2.16,2.72
  pour L1-HS (isolate 0.178, rank 6, no thermals): -0.7,42.01 22.63,42.01 22.63,2.73 -0.7,2.73
  pour L6-SIG (isolate 0.178, rank 6, no thermals): -2.52,42.01 24.13,42.01 24.13,2.71 -2.52,2.71
  pour L4-SIG (isolate 0.178, no thermals): -1.76,42 23.53,42 23.53,2.71 -1.76,2.71
GP0  (via drill 0.15)
  L1-HS 0.17: IC4.2 15.75,28.55 16.27,28.02 16.27,20.11 16.25,20.11 | v10.03,18.82 9.94,18.91 8.22,18.91 7.82,18.52 R29.2 | v15.75,20.09 15.77,20.11 16.25,20.11 | M.2-M1.P$31 12.75,3.19 13.04,3.48 13.04,3.92 16.27,7.16 16.27,17.99 15.8,18.47 15.8,18.95 16.27,19.43 16.27,20.09 16.25,20.11
  L4-SIG 0.147: v10.03,18.82 10.41,18.82 10.75,19.16 12.28,19.16 13.22,18.22 15.16,18.22 15.75,18.81 v15.75,20.09
GP1  (via drill 0.15)
  L1-HS 0.17: IC4.3 15.85,28.95 16.62,28.17 16.62,18.72 | v10.99,18.57 10.63,18.57 10.21,18.16 R31.1 | M.2-M1.P$29 13.25,3.15 13.42,3.32 13.42,3.81 16.62,7.01 16.62,18.72 | v16.39,18.71 16.62,18.71 16.62,18.72
  L6-SIG 0.17: v10.99,18.57 11.89,18.57 12.08,18.76 12.68,18.76 13.22,18.22 15.9,18.22 v16.39,18.71
GP2
  L1-HS 0.17: IC4.4 15.99,29.35 16.98,28.36 16.98,6.86 13.81,3.7 13.81,1.71 M.2-M1.P$27
GP3
  L1-HS 0.17: IC4.5 16.13,29.75 17.33,28.55 17.33,6.72 14.25,3.64 M.2-M1.P$25
GP4  (via drill 0.15)
  L1-HS 0.17: v13.52,29.15 13.52,29.69 13.74,29.91 13.74,30.01 13.88,30.15 IC4.6 16.26,30.15 17.68,28.73 17.68,6.57 14.75,3.64 M.2-M1.P$23
  L6-SIG 0.17: v13.52,29.15 14.7,29.15 15.12,29.57 R23.2 R4.1
GP5  (via drill 0.15)
  L1-HS 0.17: 16.98,29.93 18.03,28.88 18.03,6.43 15.25,3.65 M.2-M1.P$21 | 16.98,29.93 17.19,29.93 v17.44,30.18 | IC4.7 16.36,30.55 16.98,29.93
  L6-SIG 0.17: R24.2 15.47,31.17 | 15.47,31.17 15.88,31.17 R3.1 | 15.47,31.17 15.47,30.77 15.59,30.65 15.61,30.65 15.62,30.66 16.73,30.66 17.2,30.18 v17.44,30.18
GP6
  L1-HS 0.17: IC4.8 15.08,30.95 15.55,31.42 17.04,31.42 18.38,30.07 18.38,6.28 15.81,3.71 15.81,1.71 M.2-M1.P$19
GP7
  L1-HS 0.17: IC4.9 14.98,31.35 15.41,31.78 17.18,31.78 18.74,30.22 18.74,6.14 16.31,3.71 16.31,1.71 M.2-M1.P$17
GP8  (via drill 0.15)
  L1-HS 0.17: v7.86,13.49 7.82,13.53 R13.1 | M.2-M1.P$15 16.81,1.71 16.81,3.71 19.09,5.99 19.09,30.38 17.32,32.15 IC4.11 13.71,32.15 13.41,32.45 v13.41,32.7
  L4-SIG 0.147: v13.41,32.7 14.9,32.7 15.67,31.93 15.67,30.3 16.45,29.52 16.45,21.62 15.16,20.33 15.16,19.52 v14.55,18.91
  L6-SIG 0.17: v14.55,18.91 15.75,18.91 16.14,19.3 16.63,19.3 16.98,18.95 16.98,18.47 16.09,17.58 10.4,17.58 10.26,17.72 9.77,17.72 9.63,17.58 8.97,17.58 7.86,16.47 v7.86,13.49
GP9  (via drill 0.15)
  L1-HS 0.17: IC4.12 16.48,32.55 | 16.48,32.55 17.42,32.55 19.44,30.53 19.44,5.84 17.25,3.65 M.2-M1.P$13 | v12.32,18.17 11.96,17.81 R12.2 | v16.48,32.74 16.48,32.55
  L4-SIG 0.147: v12.32,18.17 12.77,18.17 13.07,17.87 16.53,17.87 16.96,18.3 16.96,29.51 16.02,30.45 16.02,31.96 16.48,32.42 v16.48,32.74
GP10
  L1-HS 0.17: M.2-M1.P$11 17.81,1.71 17.81,3.72 19.79,5.7 19.79,30.63 19.79,30.67 17.13,33.33 16.24,33.33 15.86,32.95 IC4.13
GP11
  L1-HS 0.17: M.2-M1.P$9 18.31,1.71 18.31,3.72 20.14,5.55 20.14,30.82 17.28,33.68 16.09,33.68 15.76,33.35 IC4.14
GP12
  L1-HS 0.17: IC4.15 13.95,34.53 16.92,34.53 20.5,30.96 20.5,5.41 18.81,3.72 18.81,1.71 M.2-M1.P$7
GP13
  L1-HS 0.17: IC4.16 13.2,34.73 13.36,34.89 17.07,34.89 20.85,31.11 20.85,5.26 19.31,3.73 19.31,1.71 M.2-M1.P$5
GP14
  L1-HS 0.17: IC4.17 12.8,35.05 12.99,35.24 17.21,35.24 21.2,31.25 21.2,5.12 19.81,3.73 19.81,1.71 M.2-M1.P$3
GP15
  L1-HS 0.17: IC4.18 12.4,35.19 12.8,35.59 17.36,35.59 21.55,31.4 21.55,4.97 20.25,3.67 M.2-M1.P$1
GP16  (via drill 0.15)
  L1-HS 0.17: IC4.27 8.77,34.21 8.77,34.65 8.55,34.87 7.25,34.87 v7.25,35.18
  L6-SIG 0.17: v7.25,35.18 7.22,35.16 5.29,35.16 4.08,33.95 4.08,32.88 4.32,32.64 4.32,24.38 3.53,23.59 3.53,21.04 1.01,18.52 1.01,16.49 1.98,15.53 2.78,15.53 4.62,13.68 4.62,12.02 5.11,11.53 5.11,9.14 5.11,8.71 6.58,7.24 9.54,7.24 13.5,3.28 M.2-M1.P$28
GP17  (via drill 0.15)
  L1-HS 0.17: IC4.28 7.04,34.19 v6.66,34.57
  L6-SIG 0.17: v6.66,34.57 6.27,34.57 6.24,34.6 5.23,34.6 4.43,33.81 4.43,33.03 4.67,32.79 4.67,24.23 3.88,23.45 3.88,20.89 1.36,18.37 1.36,16.63 2.12,15.88 3.58,15.88 4.97,14.48 4.97,12.17 5.47,11.68 5.47,8.85 6.73,7.59 9.69,7.59 13.05,4.23 13.38,4.23 14,3.61 M.2-M1.P$26
GP18  (via drill 0.15)
  L1-HS 0.17: IC4.29 6.83,33.35 6.17,34.01 v6,34.01
  L6-SIG 0.17: M.2-M1.P$24 14.5,4.13 14.05,4.58 13.19,4.58 9.83,7.94 6.88,7.94 5.82,9 5.82,11.83 5.33,12.32 5.33,14.63 3.72,16.23 2.27,16.23 1.72,16.78 1.72,18.22 4.24,20.74 4.24,23.3 5.02,24.09 5.02,32.93 4.78,33.17 4.78,33.66 5.13,34.01 v5.99,34.01 v6,34.01
GP19  (via drill 0.15)
  L1-HS 0.17: IC4.30 5.84,32.95 v5.37,33.42
  L6-SIG 0.17: v5.37,33.42 5.37,23.94 4.59,23.16 4.59,20.6 2.07,18.08 2.07,16.93 2.41,16.58 2.9,16.58 2.91,16.59 3.86,16.59 12.52,7.93 12.52,5.75 13.34,4.93 14.2,4.93 15,4.13 M.2-M1.P$22
GP20  (via drill 0.15, 0.2)
  L1-HS 0.17: IC4.31 5.46,32.55 2.42,29.5 2.42,20.03 2.66,19.79 v2.66,17.17
  L4-SIG 0.147: v2.66,17.17 2.66,14.12 2.45,13.91 2.45,9.96 5.17,7.25 5.25,7.16 5.96,6.46 7.99,6.46 8.39,6.86 12.36,6.86 v13.22,5.99
  L6-SIG 0.17: v13.22,5.99 13.94,5.28 14.42,5.28 15.5,4.2 M.2-M1.P$20
GP21  (via drill 0.15, 0.2)
  L1-HS 0.17: IC4.32 5.56,32.15 2.77,29.36 2.77,20.27 3.2,19.84 3.2,18.03 3.33,17.9 v3.25,17.81
  L4-SIG 0.147: v3.25,17.81 4.43,16.63 4.43,15.39 2.81,13.77 2.81,10.11 6.08,6.83 7.83,6.83 8.23,7.23 12.88,7.23 v14.17,5.94
  L6-SIG 0.17: M.2-M1.P$18 16,4.27 14.32,5.95 14.18,5.95 v14.17,5.94
GP22  (via drill 0.15, 0.2)
  L1-HS 0.17: IC4.34 5.26,31.35 3.12,29.21 3.12,20.49 3.7,19.91 3.7,18.54 v3.82,18.42
  L4-SIG 0.147: v14.18,6.84 13.42,7.6 8.07,7.59 7.69,7.21 6.2,7.21 3.16,10.25 3.16,13.62 4.78,15.24 4.78,17.46 v3.82,18.42
  L6-SIG 0.17: M.2-M1.P$16 16.5,4.52 v14.18,6.84
GP23  (via drill 0.15, 0.2)
  L1-HS 0.17: IC4.35 5.36,30.95 3.47,29.07 3.47,20.68 4.16,19.99 4.16,19.31 v4.38,19.09
  L4-SIG 0.147: v4.38,19.09 5.13,18.34 5.13,15.09 3.51,13.47 3.51,10.4 6.34,7.57 7.54,7.57 7.93,7.96 13.97,7.96 14.01,7.92 14.94,6.99 v15.2,6.99
  L6-SIG 0.17: v15.2,6.99 15.2,6.4 17,4.6 M.2-M1.P$14
GP24  (via drill 0.15, 0.2)
  L1-HS 0.17: IC4.36 5.45,30.55 3.82,28.92 3.82,21.16 4.91,20.07 v4.91,19.74
  L4-SIG 0.147: v4.91,19.74 5.48,19.16 5.48,14.95 3.86,13.33 3.86,10.55 6.48,7.93 7.4,7.93 7.79,8.32 14.15,8.32 14.72,7.75 v15.66,7.75
  L6-SIG 0.17: M.2-M1.P$12 17.5,4.64 15.87,6.28 15.87,7.54 v15.66,7.75
GP25  (via drill 0.15, 0.2)
  L1-HS 0.17: IC4.37 7.54,30.13 5.53,30.13 4.18,28.78 4.18,21.6 4.95,20.82 4.99,20.82 v5.23,20.59 | 14.83,8.62 v15.05,8.4 | R11.2 13.04,9.36 12.75,9.65 8.62,9.65 v8.53,9.74
  L4-SIG 0.147: v5.23,20.59 5.44,20.59 5.83,20.2 5.83,14.8 4.27,13.24 4.27,11.88 5.23,10.92 9.85,10.92 10.72,10.04 | 10.72,10.04 10.79,9.98 8.77,9.98 v8.53,9.74 | 10.82,9.94 10.88,9.89 | 10.88,9.89 12.09,8.67 14.78,8.67 v15.05,8.4 | 10.88,9.89 10.72,10.04
  L6-SIG 0.17: v15.05,8.4 17.08,8.4 18,7.48 M.2-M1.P$10
I2C0_SCL  (via drill 0.2)
  L1-HS 0.17: v19.43,34.4 19.43,36.16 IC1.6
  L6-SIG 0.17: R3.2 17.92,31.19 19.43,32.7 v19.43,34.4
I2C0_SDA  (via drill 0.2)
  L1-HS 0.17: v18.64,35.17 18.95,35.48 IC1.5
  L6-SIG 0.17: R4.2 16.57,30.22 17.2,29.59 17.69,29.59 18.03,29.94 18.03,30.72 19.84,32.53 19.84,33.94 20.05,34.14 20.05,34.65 19.69,35.01 18.8,35.01 v18.64,35.17
MUXSEL  (via drill 0.15)
  L1-HS 0.17: R7.1 R5.2 | R5.2 R11.1 | R5.2 13.92,7.55 13.32,6.96 10.34,6.96 v9.66,6.28 | v5.26,6.29 5.26,9.05 IC2.10
  L4-SIG 0.147: v9.66,6.28 8.29,6.28 8.13,6.12 5.43,6.12 v5.26,6.29
N$2  (via drill 0.15)
  L4-SIG 0.17: v4.65,36.84 3.57,35.76 1.86,35.76 1.16,36.46 v1.16,36.63
  L6-SIG 0.17: J2.1 5.25,38.36 J1.2 5.25,37.45 v4.65,36.84 | v1.16,36.63 1.33,36.46 IC8.3
N$6
  L1-HS 0.17: R16.1 5.22,5.43 5.49,5.7 6.09,5.7 DETECT.A
N$9
  L6-SIG 0.17: 1.5,41.62 0.5,41.62 0.5,40.12 1.5,40.12 | 1.5,41.62 2.4,41.62 | 3.4,41.62 4.4,41.62 | 5.4,41.62 6.4,41.62 6.4,40.12 4.4,40.12 | 3.4,40.12 2.4,40.12 | 1.5,41.62 1.5,40.12 | 1.5,40.12 2.4,40.12 | 2.4,40.12 2.4,41.62 | 2.4,41.62 3.4,41.62 | 3.4,41.62 3.4,40.12 | 3.4,40.12 4.4,40.12 | 4.4,40.12 4.4,41.62 | 4.4,41.62 5.4,41.62 | 5.4,41.62 5.4,40.12
N$10
  L5-GND 0.17: 1.5,41.62 0.5,41.62 0.5,40.12 1.5,40.12 | 1.5,41.62 2.4,41.62 | 3.4,41.62 4.4,41.62 | 5.4,41.62 6.4,41.62 6.4,40.12 4.4,40.12 | 3.4,40.12 2.4,40.12 | 1.5,41.62 1.5,40.12 | 1.5,40.12 2.4,40.12 | 2.4,40.12 2.4,41.62 | 2.4,41.62 3.4,41.62 | 3.4,41.62 3.4,40.12 | 3.4,40.12 4.4,40.12 | 4.4,40.12 4.4,41.62 | 4.4,41.62 5.4,41.62 | 5.4,41.62 5.4,40.12
N$11
  L4-SIG 0.17: 1.5,41.62 0.5,41.62 0.5,40.12 1.5,40.12 | 1.5,41.62 2.4,41.62 | 3.4,41.62 4.4,41.62 | 5.4,41.62 6.4,41.62 6.4,40.12 4.4,40.12 | 3.4,40.12 2.4,40.12 | 1.5,41.62 1.5,40.12 | 1.5,40.12 2.4,40.12 | 2.4,40.12 2.4,41.62 | 2.4,41.62 3.4,41.62 | 3.4,41.62 3.4,40.12 | 3.4,40.12 4.4,40.12 | 4.4,40.12 4.4,41.62 | 4.4,41.62 5.4,41.62 | 5.4,41.62 5.4,40.12
N$13
  L3-PWR 0.17: 1.5,41.62 0.5,41.62 0.5,40.12 1.5,40.12 | 1.5,41.62 2.4,41.62 | 3.4,41.62 4.4,41.62 | 5.4,41.62 6.4,41.62 6.4,40.12 4.4,40.12 | 3.4,40.12 2.4,40.12 | 1.5,41.62 1.5,40.12 | 1.5,40.12 2.4,40.12 | 2.4,40.12 2.4,41.62 | 2.4,41.62 3.4,41.62 | 3.4,41.62 3.4,40.12 | 3.4,40.12 4.4,40.12 | 4.4,40.12 4.4,41.62 | 4.4,41.62 5.4,41.62 | 5.4,41.62 5.4,40.12
N$14
  L2-GND 0.17: 1.5,41.62 0.5,41.62 0.5,40.12 1.5,40.12 | 1.5,41.62 2.4,41.62 | 3.4,41.62 4.4,41.62 | 5.4,41.62 6.4,41.62 6.4,40.12 4.4,40.12 | 3.4,40.12 2.4,40.12 | 1.5,41.62 1.5,40.12 | 1.5,40.12 2.4,40.12 | 2.4,40.12 2.4,41.62 | 2.4,41.62 3.4,41.62 | 3.4,41.62 3.4,40.12 | 3.4,40.12 4.4,40.12 | 4.4,40.12 4.4,41.62 | 4.4,41.62 5.4,41.62 | 5.4,41.62 5.4,40.12
N$15
  L1-HS 0.17: 1.5,41.62 0.5,41.62 0.5,40.12 1.5,40.12 | 1.5,41.62 2.4,41.62 | 3.4,41.62 4.4,41.62 | 5.4,41.62 6.4,41.62 6.4,40.12 4.4,40.12 | 3.4,40.12 2.4,40.12 | 1.5,41.62 1.5,40.12 | 1.5,40.12 2.4,40.12 | 2.4,40.12 2.4,41.62 | 2.4,41.62 3.4,41.62 | 3.4,41.62 3.4,40.12 | 3.4,40.12 4.4,40.12 | 4.4,40.12 4.4,41.62 | 4.4,41.62 5.4,41.62 | 5.4,41.62 5.4,40.12
N$43
  L1-HS 0.17: IC7.22 14.33,14.72 R10.1
N$53
  L1-HS 0.17: R6.1 C29.1 14.87,38.05 X1.1
N$109
  L1-HS 0.17: IC7.21 14.37,14.22 R9.1
N$110  (via drill 0.15)
  L1-HS 0.17: v15.68,13.98 15.15,13.98 R9.2 | TX.C 13.24,17.14 13.24,17.07 14.16,16.16 14.37,16.16 14.74,15.79 v15.16,15.79
  L4-SIG 0.147: 15.66,13.96 v15.68,13.98
  L6-SIG 0.17: v15.16,15.79 15.16,14.5 v15.68,13.98
N$111
  L1-HS 0.17: R10.2 15.51,14.85 15.91,15.25 15.91,17.13 RX.C
QSPI_SCLK  (via drill 0.15)
  L1-HS 0.17: IC3.B2 13.01,21.32 v13.03,21.32 | v11.62,25.81 11.66,25.85 arc45 12,26.67 IC4.52
  L4-SIG 0.147: v11.62,25.81 11.62,25.38 arc90 11.8,25.2 12.26,25.2 arc-90 12.43,25.03 12.43,24.87 arc-90 12.26,24.7 11.8,24.7 arc90 11.62,24.52 11.62,24.37 arc90 11.8,24.19 12.26,24.19 arc-90 12.43,24.01 12.43,23.86 arc-90 12.26,23.68 11.8,23.68 arc90 11.62,23.51 11.62,23.4 arc45 12.09,22.26 v13.03,21.32
QSPI_SD0
  L1-HS 0.17: IC3.D3 10.41,20.92 arc-45 10.06,21.07 9.93,21.19 arc45 9.6,21.33 9.59,21.33 arc-45 9.15,21.51 arc-90 9.15,22.18 arc-45 9.53,22.33 arc90 9.95,22.75 9.95,22.98 arc-45 10.16,23.5 10.56,23.89 arc90 10.56,24.14 10.3,24.4 arc-90 10.3,24.65 10.37,24.72 arc-90 10.62,24.72 10.88,24.46 arc90 11.12,24.46 12.06,25.39 arc45 12.4,26.22 IC4.53
QSPI_SD1
  L1-HS 0.17: 13.17,27.29 IC4.55 13.2,25.01 arc-45 13.13,24.84 arc90 13.13,24.59 13.43,24.29 arc-90 13.43,24.04 13.4,24 arc-90 13.15,24 12.85,24.31 arc90 12.6,24.31 12.6,24.3 arc90 12.6,23.91 13.08,23.42 arc-90 13.08,23.17 arc-90 12.82,23.17 12.33,23.65 arc90 12.05,23.65 arc45 11.95,23.4 11.95,22.78 arc-45 11.83,22.5 11.74,22.41 arc-45 11.54,22.33 11.32,22.33 arc45 11.2,22.28 10.75,21.83 IC3.D2
QSPI_SD2
  L1-HS 0.17: IC3.C4 11.5,20.16 11.15,20.51 arc-45 11.06,20.72 11.06,20.77 11.06,20.87 arc90 10.62,21.3 10.55,21.3 arc-45 10.18,21.45 arc-45 10,21.88 arc-45 10.13,22.18 arc-45 10.51,22.34 10.47,22.34 arc45 10.75,22.46 10.91,22.62 arc45 11,22.83 11,23.11 arc-45 11.09,23.32 11.92,24.16 arc90 11.92,24.41 arc-90 11.92,24.66 11.98,24.71 arc-90 12.23,24.71 arc90 12.48,24.71 12.61,24.84 arc45 12.8,25.3 IC4.54
QSPI_SD3  (via drill 0.15)
  L1-HS 0.17: IC4.51 11.6,26.91 arc-45 11.39,26.42 11.19,26.21 arc45 10.92,25.56 v10.92,25.34 | v10,20.32 v10.01,20.32 IC3.D4
  L4-SIG 0.147: v10.92,25.34 10.92,24.79 arc-90 10.74,24.61 10.65,24.61 arc90 10.47,24.44 10.47,24.44 arc90 10.65,24.26 10.74,24.26 arc-90 10.92,24.08 10.92,24.08 arc-90 10.74,23.91 10.65,23.91 arc90 10.47,23.73 10.47,23.73 arc90 10.65,23.55 10.74,23.55 arc-90 10.92,23.38 10.92,23.38 arc-90 10.74,23.2 10.65,23.2 arc90 10.47,23.02 10.47,23.02 arc90 10.65,22.85 10.74,22.85 arc-90 10.92,22.67 10.92,21.87 arc-45 10.47,20.79 v10,20.32
REGO  (via drill 0.2)
  L1-HS 0.17: IC7.16 12.79,11.63 | 12.79,11.63 12.79,11.16 v13.08,10.87 | R15.1 14.78,11.63 12.79,11.63
  L6-SIG 0.17: C4.1 13.27,11.06 v13.08,10.87
RP_XI
  L1-HS 0.17: X1.3 17.19,36.7 16.26,37.63 14.9,37.63 14.56,37.29 C28.1 14.11,37.28 13.29,36.47 12.5,36.47 11.6,35.57 IC4.20
RP_XO
  L1-HS 0.17: IC4.21 11.2,35.71 12.34,36.85 13.09,36.85 13.5,37.26 R6.2
RUN  (via drill 0.15)
  L1-HS 0.17: R8.2 8.76,35.58 v8.66,35.48 9.2,34.94 IC4.26
  L4-SIG 0.147: v7.82,5.39 7.89,5.32 14.43,5.32 16.27,7.16 16.27,8.01 16.27,11.45 18.36,13.54 18.36,33.37 17.16,34.57 9.57,34.57 v8.66,35.48
  L6-SIG 0.17: M.2-M1.P$54 7,4.57 v7.82,5.39
SWCLK  (via drill 0.15)
  L1-HS 0.17: IC4.24 10,34.9 v10.54,35.44 10.22,35.76 R22.2
SWCLK_M2  (via drill 0.15)
  L1-HS 0.17: R22.1 10.22,37.47 v10.36,37.61
  L6-SIG 0.17: v10.36,37.61 10.36,37.62 9.82,38.16 7.29,38.16 3.38,34.24 3.38,32.59 3.61,32.35 3.61,24.67 2.83,23.89 2.83,21.33 0.31,18.81 0.31,16.2 1.69,14.82 2.49,14.82 3.84,13.47 3.84,11.51 3.51,11.18 3.51,10.3 4.41,9.4 4.41,8.42 6,6.83 M.2-M1.P$58
SWDIO  (via drill 0.15)
  L1-HS 0.17: IC4.25 v9.6,35.43 v9.59,35.44 9.49,35.54 R21.2
SWDIO_M2  (via drill 0.15)
  L1-HS 0.17: R21.1 9.49,37.41 v9.33,37.57
  L6-SIG 0.17: v9.33,37.57 7.2,37.57 3.73,34.1 3.73,32.73 3.97,32.5 3.97,24.53 3.18,23.74 3.18,21.18 0.66,18.66 0.66,16.34 1.83,15.17 2.63,15.17 4.27,13.53 4.27,11.45 3.86,11.03 3.86,10.45 4.76,9.55 4.76,8.56 6.5,6.82 M.2-M1.P$56
USB_DP_N
  L1-HS 0.167: IC2.2 6.16,8.24 7.21,7.19 7.21,1.69
  L1-HS 0.17: 7.21,1.69 M.2-M1.P$53
USB_DP_P
  L1-HS 0.167: IC2.1 5.76,8.14 6.8,7.11 6.8,1.7
  L1-HS 0.17: 6.8,1.7 M.2-M1.P$55
USBFT_DP_N
  L1-HS 0.167: IC7.15 12.29,11.16 12.2,11.07 12.2,10.53 11.67,10 10.79,10 9.21,10 7.76,11.44 6.42,11.44 | IC2.6 6.16,11.18
  L1-HS 0.17: 6.16,11.18 6.42,11.44
USBFT_DP_P
  L1-HS 0.167: IC7.14 11.79,11.14 11.86,11.07 11.86,10.67 11.53,10.34 9.35,10.34 7.9,11.79 6.26,11.79 5.76,11.29 IC2.7
USBRP2_DP_N
  L1-HS 0.167: IC4.46 9.6,26.2 R32.2
USBRP2_DP_P
  L1-HS 0.167: IC4.47 10,26.18 R33.2
USBRP_DP_N  (via drill 0.15)
  L1-HS 0.167: R32.1 9.44,25.18 9.23,24.98 8.66,24.98 6.17,22.48 6.17,12.56
  L1-HS 0.17: 6.17,12.56 v5.92,12.56 | IC2.4 7.34,9.55 v7.55,9.34
  L6-SIG 0.167: 6.17,12.56 6.17,10.17 6.76,9.58 7.55,9.58 v7.55,9.34
  L6-SIG 0.17: 6.17,12.56 v5.92,12.56
USBRP_DP_P  (via drill 0.15)
  L1-HS 0.167: R33.1 10.15,25.39 9.38,24.62 8.8,24.62 6.51,22.33 6.51,12.57 v6.76,12.57
  L1-HS 0.17: IC2.5 7.29,9.95 v7.53,10.19
  L6-SIG 0.167: 6.52,12.57 6.52,10.3 6.88,9.94 7.53,9.94 v7.53,10.19
  L6-SIG 0.17: 6.52,12.57 v6.76,12.57
VBUS  (via drill 0.15)
  L1-HS 0.17: 1.98,1.65 M.2-M1.P$73 | 1.98,1.65 1.98,0.53 2,0.51 2,1.1 | IC7.19 v14.23,13.21 R14.2 | IC6.3 0.66,4.8 | 0.66,4.8 0.45,5.01 0.45,5.06 0.45,6.54 | IC6.1 0.61,6.7 0.45,6.54 | C25.1 0.45,6.54 | v0.52,5.01 0.66,4.87 0.66,4.8 | TX.A 14.63,17.42 | 14.63,17.42 RX.A | 14.63,17.42 14.63,16.8 v14.79,16.65 | M.2-M1.P$75 1.98,1.65
  L1-HS 0.305: IC6.3 2,4.36 2,1.1
  L3-PWR 0.305: v14.79,16.65 14.37,16.23 13.86,16.23 13.47,15.84 13.47,15.3 14.23,14.54 v14.23,13.21
  L3-PWR 0.406: v14.23,13.21 14.08,13.06 13.82,13.06 13.39,12.63 13.39,12.37 12.87,11.85 4.51,11.85 3.58,10.91 3.58,9.09 2.37,7.89 1.42,7.89 0.52,7 v0.52,5.01
  L6-SIG 0.17: v0.52,5.01 0.63,5.11 C1.1 1.65,4.57
  L6-SIG 0.254: M.2-M1.P$74 2,2.69 1.65,3.04 1.65,4.57
  L6-SIG 0.508: C1.1 1.65,0.78 1.78,0.65
VCCIO  (via drill 0.15)
  L1-HS 0.17: IC7.1 8.61,15.85 C6.1 C3.1 9.92,17.04 v10.02,17.13 | R14.1 R15.2 15.11,12.28 v15.68,11.7
  L3-PWR 0.174: v10.02,17.13 14.09,17.13 14.29,17.33 15.14,17.33 15.75,16.72 15.75,15.05 15.06,14.36 15.09,14.33 15.09,13.74 15.68,13.15 v15.68,11.7
VCORE  (via drill 0.15, 0.2)
  L1-HS 0.17: IC4.23 10.4,33.54 v10.1,33.24 | IC4.50 11.2,27.96 11.23,27.99 11.23,28.01 v11.48,28.26 | C31.1 2.49,37.54 v2.93,37.1 | J3.2 7.46,25.18 v7.46,24.79
  L3-PWR 0.174: v7.46,24.79 8.77,24.79 11.34,27.36 11.34,28.12 v11.48,28.26
  L3-PWR 0.2: v11.48,28.26 11.48,28.6 11.13,28.95 9.29,28.95 9.18,29.06 9.18,32.65 | v10.1,33.24 9.77,33.24 9.18,32.65 | 7.17,37.28 7.17,36.27 8.06,35.38 8.06,33.77 9.18,32.65
  L3-PWR 0.203: 7.17,37.28 6.13,38.32 3.85,38.32 2.93,37.39 v2.93,37.1
  L6-SIG 0.17: C24.1 12.16,28.26 v11.48,28.26 | C22.1 10.03,33.17 v10.1,33.24 | R27.1 3.27,39.16 | 3.27,39.16 C9.1 | 3.27,39.16 3.23,39.12 IC8.5 3.23,37.4 v2.93,37.1
VFB
  L6-SIG 0.17: R28.1 1.16,39.16 1.29,39.16 | 1.29,39.16 R27.2 | IC8.4 1.33,39.12 1.29,39.16
VREF  (via drill 0.15)
  L1-HS 0.17: C32.1 1.43,26.23 v1.8,25.86
  L6-SIG 0.17: IC5.3 0.76,29.41 R2.1 0.85,29.23 0.85,28.01 | v1.8,25.86 v1.8,25.87 REF1.1 0.85,28.01 | C10.1 0.89,28.05 0.85,28.01
VREGO
  L1-HS 0.17: IC4.45 9.2,26.77 C23.1 8.71,25.88 J3.1

### Text on the board
L1-HS: 1
L2-GND: 2
L3-PWR: 3
L4-SIG: 4
L5-GND: 5
L6-SIG: 6
tNames: VCORE | J3 | R11/01 | T11 | T01 | M1 | M2 | M3
bNames: DvidMakesThings 2025 | J2 | J1 | R3 | R4